# EAGLE schematic MotionDetectorCamera (EAGLE 9.6.2)

## Sheet 1 of 9: VDD
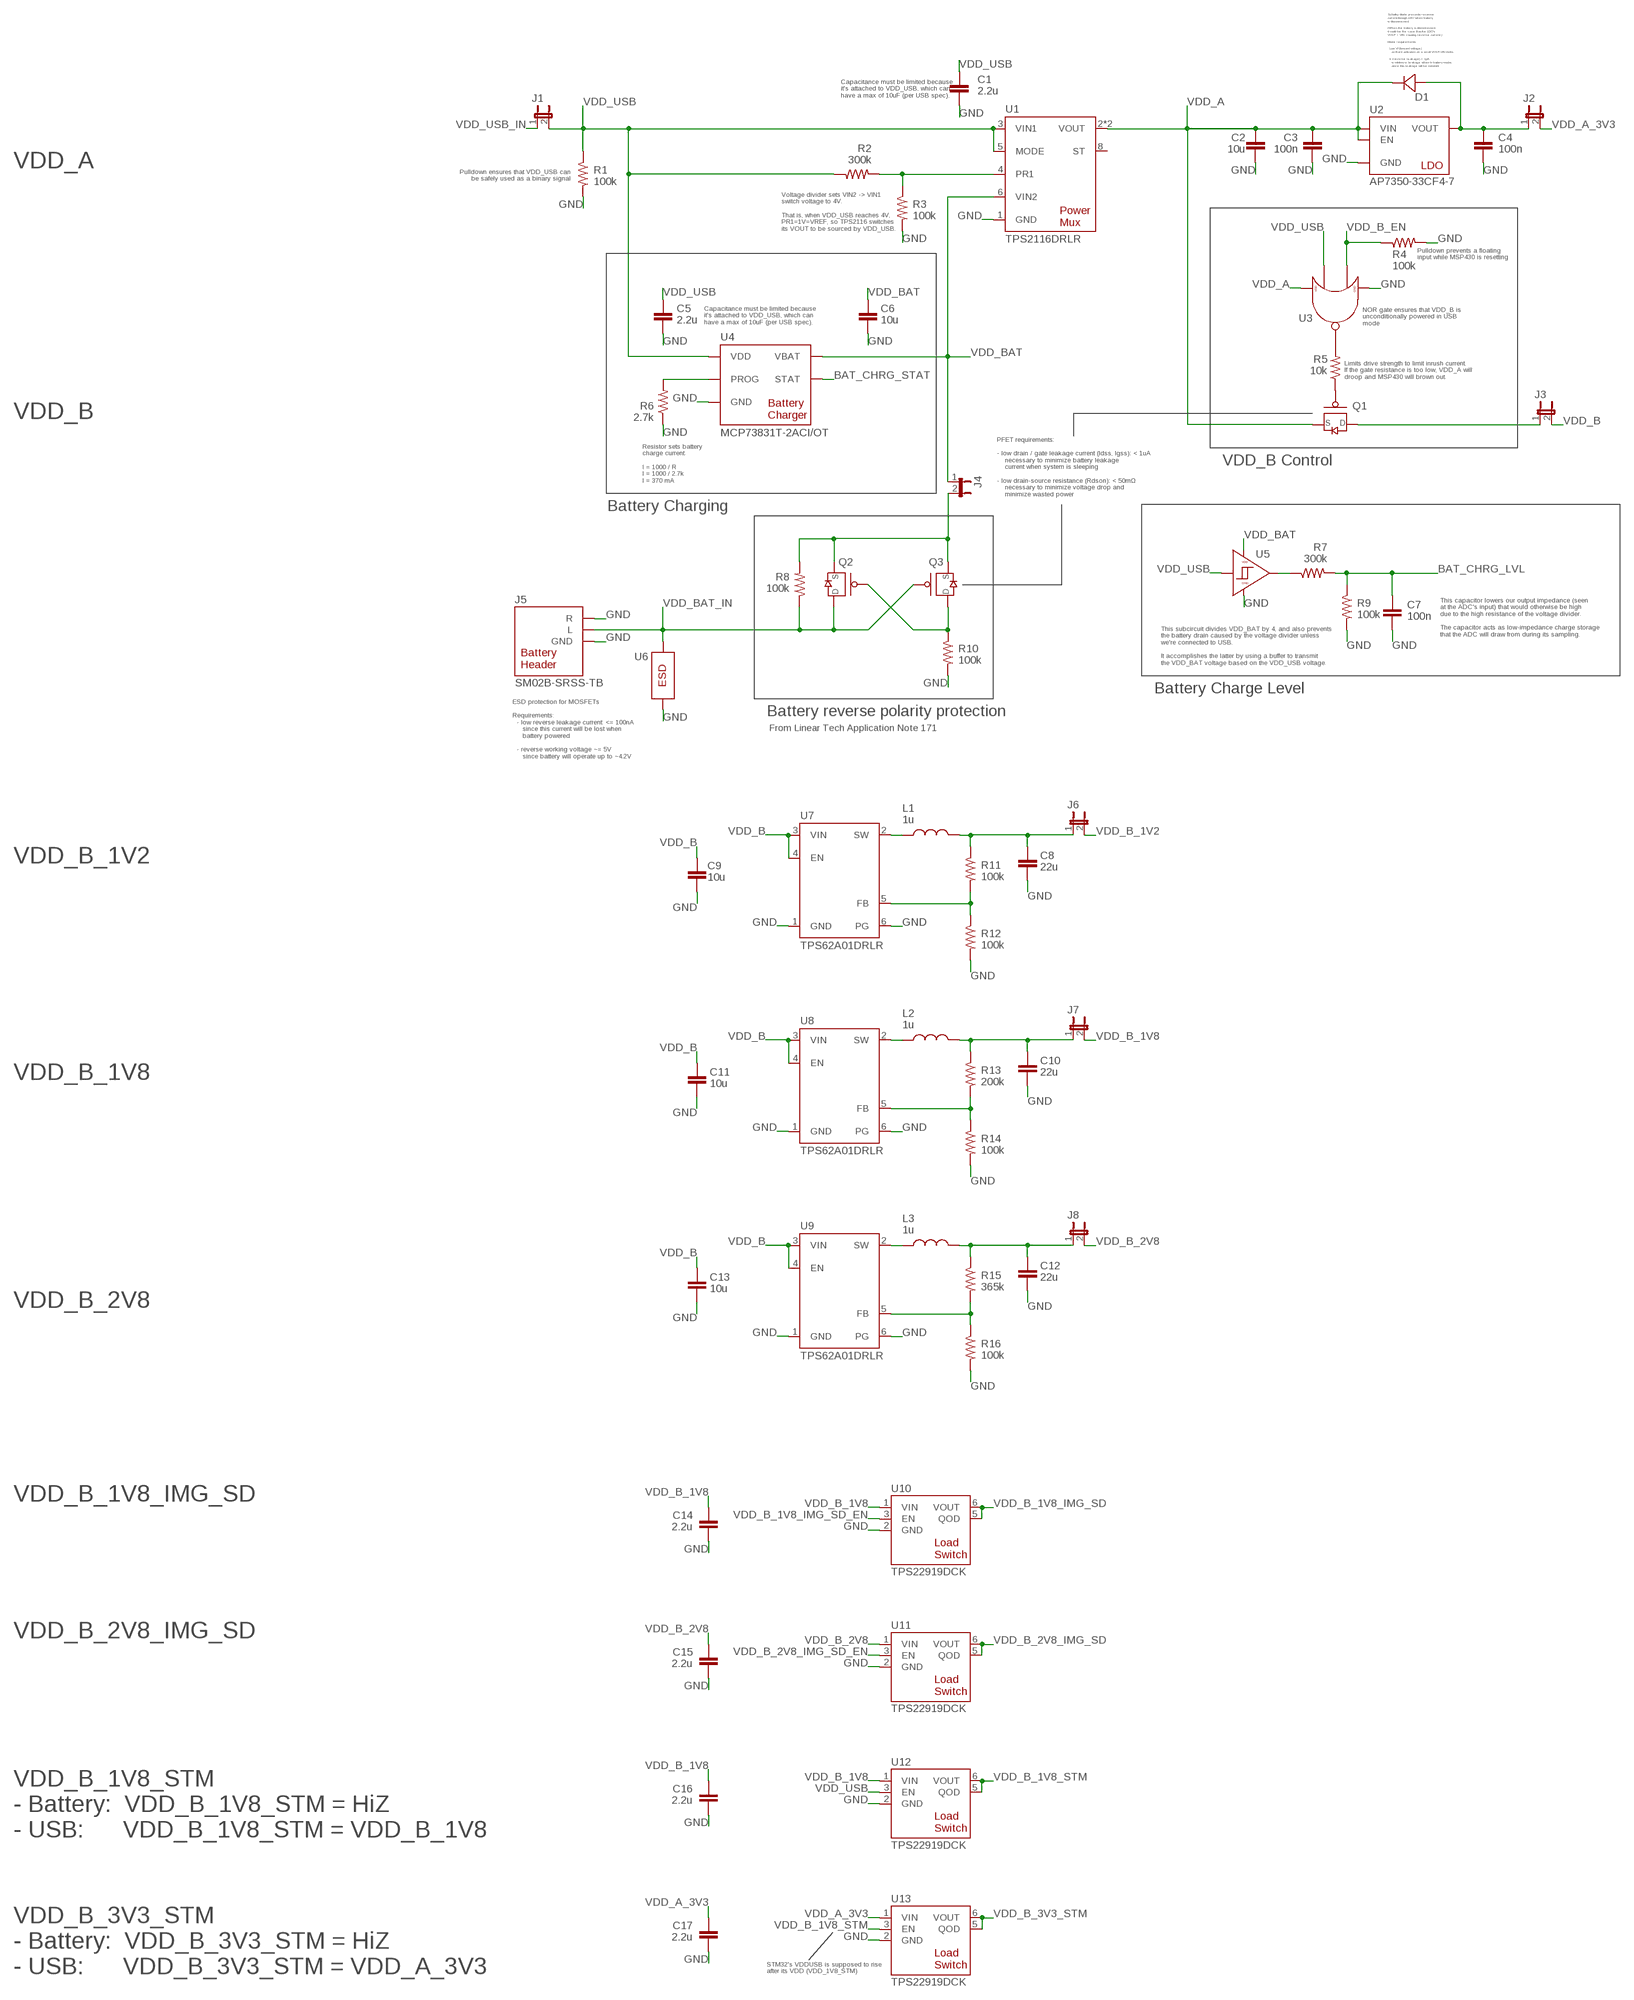
[diagram p0: schematic, sheet 1]

### Parts
C1  2.2u  CAPACITOR0402  [0402]
C2  10u  CAPACITOR0805  [0805]
C3  100n  CAPACITOR0402  [0402]
C4  100n  CAPACITOR0402  [0402]
C5  2.2u  CAPACITOR0402  [0402]
C6  10u  CAPACITOR0805  [0805]
C7  100n  CAPACITOR0402  [0402]
C8  22u  CAPACITOR0805  [0805]
C9  10u  CAPACITOR0805  [0805]
C10  22u  CAPACITOR0805  [0805]
C11  10u  CAPACITOR0805  [0805]
C12  22u  CAPACITOR0805  [0805]
C13  10u  CAPACITOR0805  [0805]
C14  2.2u  CAPACITOR0402  [0402]
C15  2.2u  CAPACITOR0402  [0402]
C16  2.2u  CAPACITOR0402  [0402]
C17  2.2u  CAPACITOR0402  [0402]
D1  ROHM-RB168MM-40  [ROHM-SOD-123FL]
J1  JUMPER-SOLDER  [JUMPER-SOLDER]
J2  JUMPER-SOLDER  [JUMPER-SOLDER]
J3  JUMPER-SOLDER  [JUMPER-SOLDER]
J4  JUMPER-SOLDER  [JUMPER-SOLDER]
J5  JST-SM02B-SRSS-TB  [JST-SM02B-SRSS-TB]
J6  JUMPER-SOLDER  [JUMPER-SOLDER]
J7  JUMPER-SOLDER  [JUMPER-SOLDER]
J8  JUMPER-SOLDER  [JUMPER-SOLDER]
L1  1u  INDUCTOR0806  [0806]
L2  1u  INDUCTOR0806  [0806]
L3  1u  INDUCTOR0806  [0806]
Q1  PMOS-NEXPERIA-SOT1220  [NEXPERIA-SOT1220]
Q2  PMOS-NEXPERIA-SOT1220  [NEXPERIA-SOT1220]
Q3  PMOS-NEXPERIA-SOT1220  [NEXPERIA-SOT1220]
R1  100k  RESISTOR0402  [0402]
R2  300k  RESISTOR0402  [0402]
R3  100k  RESISTOR0402  [0402]
R4  100k  RESISTOR0402  [0402]
R5  10k  RESISTOR0402  [0402]
R6  2.7k  RESISTOR0402  [0402]
R7  300k  RESISTOR0402  [0402]
R8  100k  RESISTOR0402  [0402]
R9  100k  RESISTOR0402  [0402]
R10  100k  RESISTOR0402  [0402]
R11  100k  RESISTOR0402  [0402]
R12  100k  RESISTOR0402  [0402]
R13  200k  RESISTOR0402  [0402]
R14  100k  RESISTOR0402  [0402]
R15  365k  RESISTOR0402  [0402]
R16  100k  RESISTOR0402  [0402]
U1  TI-TPS2116  [TI-TPS2116DRLR]
U2  DIODESINC-AP7350  [DIODESINC-AP7350]
U3  NEXPERIA-74LVC1G98-NOR  [NEXPERIA-SOT363]
U4  MICROCHIP-MCP7383X  [MICROCHIP-MIC550X-SOT23-5]
U5  NEXPERIA-74LVC1G98-BUFFER  [NEXPERIA-SOT363]
U6  EATON-STN101  [EATON-STN101]
U7  TI-TPS62A01  [TI-TPS62A01DRLR]
U8  TI-TPS62A01  [TI-TPS62A01DRLR]
U9  TI-TPS62A01  [TI-TPS62A01DRLR]
U10  TI-TPS22919DCK  [TI-TPS22919DCK]
U11  TI-TPS22919DCK  [TI-TPS22919DCK]
U12  TI-TPS22919DCK  [TI-TPS22919DCK]
U13  TI-TPS22919DCK  [TI-TPS22919DCK]

### Nets
BAT_CHRG_LVL: C7.1 R7.2 R9.1 ; also sheet 8
BAT_CHRG_STAT: U4.1(STAT) ; also sheet 8
GND: C1.2 C2.2 C3.2 C4.2 C5.2 C6.2 C7.2 C8.2 C9.2 C10.2 C11.2 C12.2 C13.2 C14.2 C15.2 C16.2 C17.2 J5.GND1(GND) J5.GND2(GND) J5.R R1.2 R3.2 R4.2 R6.1 R9.2 R10.2 R12.2 R14.2 R16.2 U1.1(GND) U2.2(GND) U3.2(GND) U4.2(GND) U5.2(GND) U5.3(GND) U6.2 U7.1(GND) U7.6(PG) U8.1(GND) U8.6(PG) U9.1(GND) U9.6(PG) U10.2(GND) U11.2(GND) U12.2(GND) U13.2(GND) ; also sheet 2,3,4,5,6,7,8,9
N$1: J4.2 Q2.4(S) Q2.8(S) Q3.4(S) Q3.8(S) R8.2
N$3: C4.1 D1.1(A) J2.1 U2.3(VOUT)
N$9: R7.1 U5.4(OUT)
N$11: Q1.3(G) R5.1
N$12: R5.2 U3.4(OUT)
N$13: C12.1 J8.1 L3.2 R15.1
N$15: L2.1 U8.2(SW)
N$18: R13.2 R14.1 U8.5(FB)
N$19: C10.1 J7.1 L2.2 R13.1
N$21: R6.2 U4.5(PROG)
N$22: L3.1 U9.2(SW)
N$24: L1.1 U7.2(SW)
N$32: Q2.3(G) Q3.1(D) Q3.2(D) Q3.5(D) Q3.6(D) Q3.7(D) R10.1
N$33: R15.2 R16.1 U9.5(FB)
N$34: R11.2 R12.1 U7.5(FB)
N$38: C8.1 J6.1 L1.2 R11.1
N$42: R2.2 R3.1 U1.4(PR1)
N$43: J3.1 Q1.1(D) Q1.2(D) Q1.5(D) Q1.6(D) Q1.7(D)
VDD_A: C2.1 C3.1 D1.2(C) Q1.4(S) Q1.8(S) U1.2(VOUT) U1.7(VOUT) U2.1(EN) U2.4(VIN) U3.3(VDD) U3.5(VDD)
VDD_A_3V3: C17.1 J2.2 U13.1(VIN) ; also sheet 2,3
VDD_B: C9.1 C11.1 C13.1 J3.2 U7.3(VIN) U7.4(EN) U8.3(VIN) U8.4(EN) U9.3(VIN) U9.4(EN)
VDD_B_1V2: J6.2 ; also sheet 4
VDD_B_1V8: C14.1 C16.1 J7.2 U10.1(VIN) U12.1(VIN) ; also sheet 2,4,6
VDD_B_1V8_IMG_SD: U10.5(QOD) U10.6(VOUT) ; also sheet 5,7
VDD_B_1V8_IMG_SD_EN: U10.3(EN) ; also sheet 2,8
VDD_B_1V8_STM: U12.5(QOD) U12.6(VOUT) U13.3(EN) ; also sheet 2,8
VDD_B_2V8: C15.1 J8.2 U11.1(VIN) ; also sheet 4
VDD_B_2V8_IMG_SD: U11.5(QOD) U11.6(VOUT) ; also sheet 5,7
VDD_B_2V8_IMG_SD_EN: U11.3(EN) ; also sheet 2,8
VDD_B_3V3_STM: U13.5(QOD) U13.6(VOUT) ; also sheet 8
VDD_B_EN: R4.1 U3.6(IN2) ; also sheet 2
VDD_BAT: C6.1 J4.1 U1.6(VIN2) U4.3(VBAT) U5.1(VDD) U5.5(VDD)
VDD_BAT_IN: J5.L Q2.1(D) Q2.2(D) Q2.5(D) Q2.6(D) Q2.7(D) Q3.3(G) R8.1 U6.1
VDD_USB: C1.1 C5.1 J1.2 R1.1 R2.1 U1.3(VIN1) U1.5(MODE) U3.1(IN1) U4.4(VDD) U5.6(IN) U12.3(EN)
VDD_USB_IN: J1.1 ; also sheet 8,9
Unconnected: U1.8(ST)

### Notes on the sheet
- Schottky diode prevents reverse
  current through LDO when battery
  is disconnected.
  
  (When the battery is disconnected,
  it could be the case that the LDO's
  VOUT > VIN, causing reverse current.)
  
  Diode requirements:
  
  - Low Vf (forward voltage)
      so that it activates on a small VOUT-VIN delta
  
  - Ir (reverse leakage) < 1µA
      to minimize leakage when in battery-mode,
      since this leakage will be constant
- Capacitance must be limited because
  it's attached to VDD_USB, which can
  have a max of 10uF (per USB spec).
- VDD_A
- Pulldown ensures that VDD_USB can
  be safely used as a binary signal
- Voltage divider sets VIN2 -> VIN1
  switch voltage to 4V.
  
  That is, when VDD_USB reaches 4V,
  PR1=1V=VREF, so TPS2116 switches
  its VOUT to be sourced by VDD_USB.
- Pulldown prevents a floating
  input while MSP430 is resetting
- Capacitance must be limited because
  it's attached to VDD_USB, which can
  have a max of 10uF (per USB spec).
- NOR gate ensures that VDD_B is
  unconditionally powered in USB
  mode
- Limits drive strength to limit inrush current.
  If the gate resistance is too low, VDD_A will
  droop and MSP430 will brown out.
- VDD_B
- PFET requirements:
  
  - low drain / gate leakage current (Idss, Igss): < 1uA
      necessary to minimize battery leakage
      current when system is sleeping
  
  - low drain-source resistance (Rdson): < 50mΩ
      necessary to minimize voltage drop and
      minimize wasted power
- Resistor sets battery
  charge current:
  
  I = 1000 / R
  I = 1000 / 2.7k
  I = 370 mA
- VDD_B Control
- Battery Charging
- This capacitor lowers our output impedance (seen
  at the ADC's input) that would otherwise be high
  due to the high resistance of the voltage divider.
  
  The capacitor acts as low-impedance charge storage
  that the ADC will draw from during its sampling.
- This subcircuit divides VDD_BAT by 4, and also prevents
  the battery drain caused by the voltage divider unless
  we're connected to USB.
  
  It accomplishes the latter by using a buffer to transmit
  the VDD_BAT voltage based on the VDD_USB voltage.
- Battery Charge Level
- ESD protection for MOSFETs
  
  Requirements:
    - low reverse leakage current: <= 100nA
       since this current will be lost when
       battery powered
  
    - reverse working voltage ~= 5V
       since battery will operate up to ~4.2V
- Battery reverse polarity protection
- From Linear Tech Application Note 171
- VDD_B_1V2
- VDD_B_1V8
- VDD_B_2V8
- VDD_B_1V8_IMG_SD
- VDD_B_2V8_IMG_SD
- VDD_B_1V8_STM
  - Battery:  VDD_B_1V8_STM = HiZ
  - USB:      VDD_B_1V8_STM = VDD_B_1V8
- VDD_B_3V3_STM
  - Battery:  VDD_B_3V3_STM = HiZ
  - USB:      VDD_B_3V3_STM = VDD_A_3V3
- STM32's VDDUSB is supposed to rise
  after its VDD (VDD_1V8_STM)

## Sheet 2 of 9: MSP
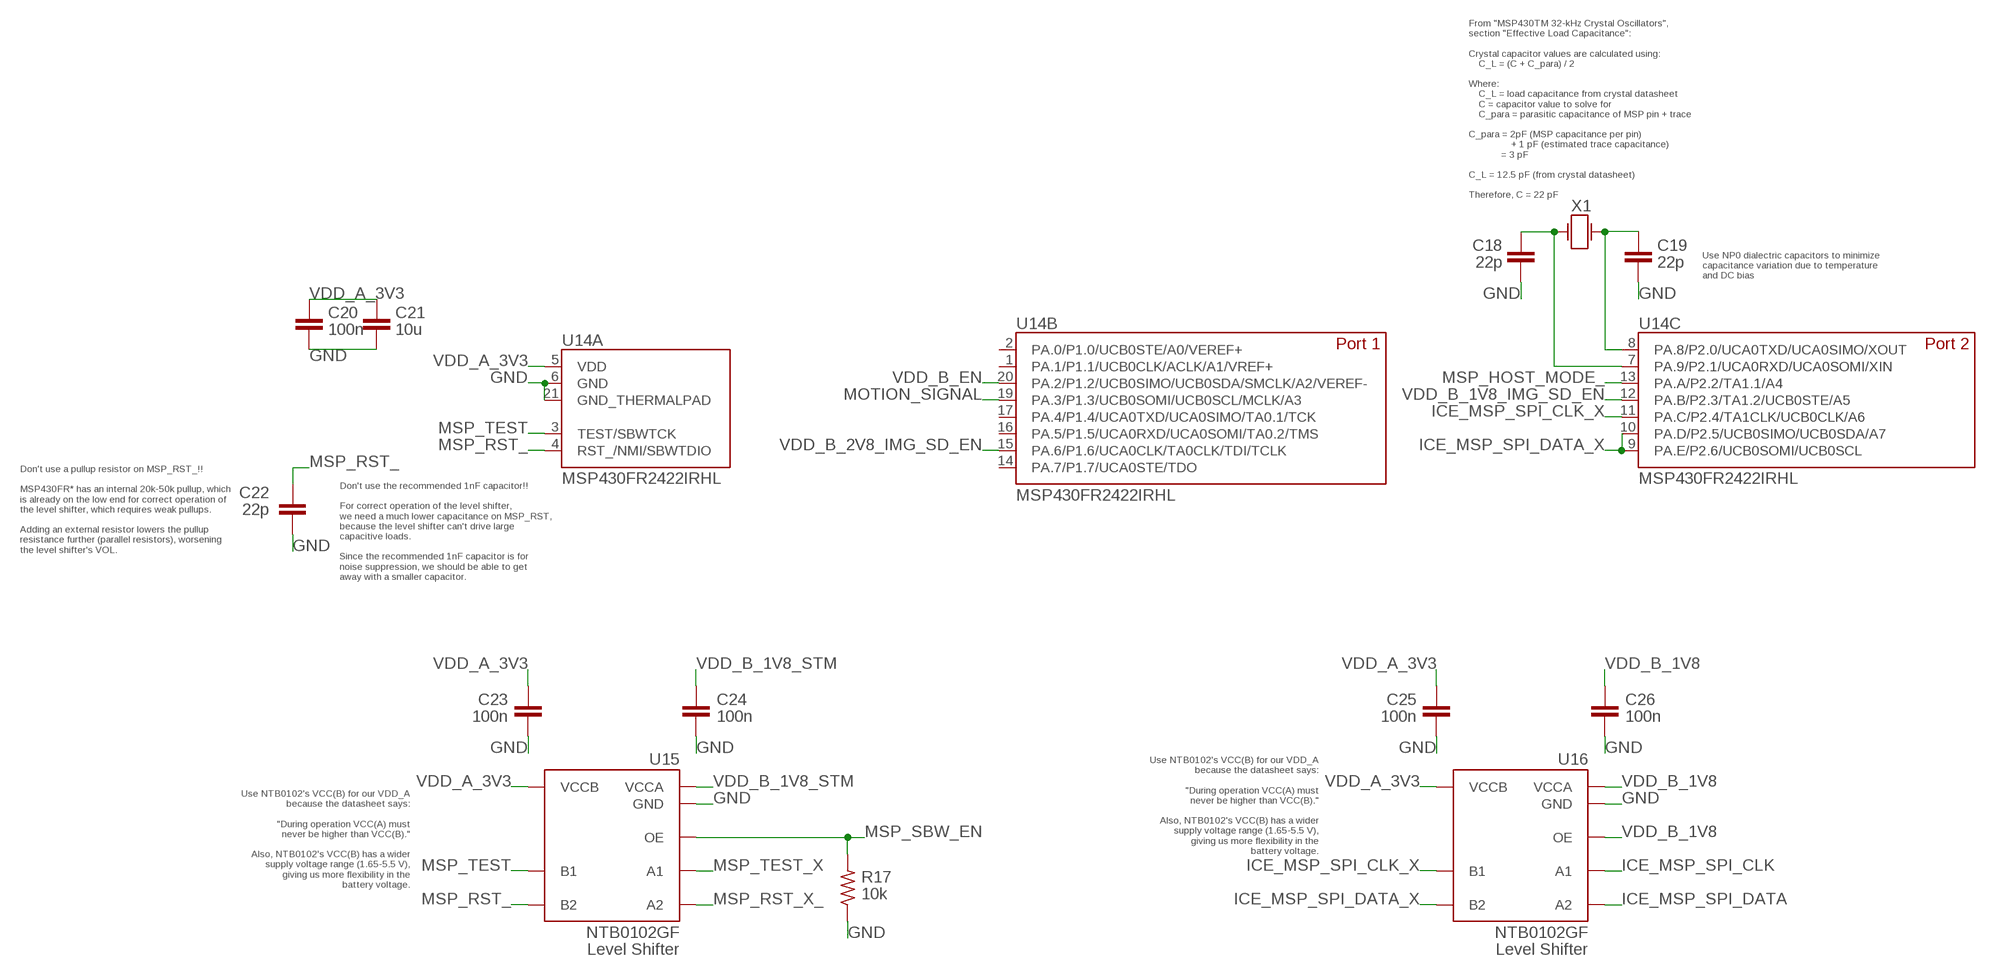
[diagram p1: schematic, sheet 2]

### Parts
C18  22p  CAPACITOR0402  [0402]
C19  22p  CAPACITOR0402  [0402]
C20  100n  CAPACITOR0402  [0402]
C21  10u  CAPACITOR0805  [0805]
C22  22p  CAPACITOR0402  [0402]
C23  100n  CAPACITOR0402  [0402]
C24  100n  CAPACITOR0402  [0402]
C25  100n  CAPACITOR0402  [0402]
C26  100n  CAPACITOR0402  [0402]
R17  10k  RESISTOR0402  [0402]
U14  TI-MSP430FR2422IRHL  [TI-MSP430FR2422IRHL]
U15  NXP-NTB0102  [NXP-NTB0102GF]
U16  NXP-NTB0102  [NXP-NTB0102GF]
X1  EPSON-FC-135  [EPSON-FC-135]

### Nets
GND: C18.2 C19.2 C20.2 C21.2 C22.2 C23.2 C24.2 C25.2 C26.2 R17.1 U14.6(A:GND) U14.21(A:GND_THERMALPAD) U15.2(GND) U16.2(GND) ; also sheet 1,3,4,5,6,7,8,9
ICE_MSP_SPI_CLK: U16.5(A1) ; also sheet 4
ICE_MSP_SPI_CLK_X: U14.11(C:PA.C/P2.4/TA1CLK/UCB0CLK/A6) U16.8(B1)
ICE_MSP_SPI_DATA: U16.4(A2) ; also sheet 4
ICE_MSP_SPI_DATA_X: U14.9(C:PA.E/P2.6/UCB0SOMI/UCB0SCL) U14.10(C:PA.D/P2.5/UCB0SIMO/UCB0SDA/A7) U16.1(B2)
MOTION_SIGNAL: U14.19(B:PA.3/P1.3/UCB0SOMI/UCB0SCL/MCLK/A3) ; also sheet 3
MSP_HOST_MODE_: U14.13(C:PA.A/P2.2/TA1.1/A4) ; also sheet 8
MSP_RST_: C22.1 U14.4(A:RST_/NMI/SBWTDIO) U15.1(B2)
MSP_RST_X_: U15.4(A2) ; also sheet 8
MSP_SBW_EN: R17.2 U15.6(OE) ; also sheet 8
MSP_TEST: U14.3(A:TEST/SBWTCK) U15.8(B1)
MSP_TEST_X: U15.5(A1) ; also sheet 8
N$14: C19.1 U14.8(C:PA.8/P2.0/UCA0TXD/UCA0SIMO/XOUT) X1.2(B)
N$17: C18.1 U14.7(C:PA.9/P2.1/UCA0RXD/UCA0SOMI/XIN) X1.1(A)
VDD_A_3V3: C20.1 C21.1 C23.1 C25.1 U14.5(A:VDD) U15.7(VCCB) U16.7(VCCB) ; also sheet 1,3
VDD_B_1V8: C26.1 U16.3(VCCA) U16.6(OE) ; also sheet 1,4,6
VDD_B_1V8_IMG_SD_EN: U14.12(C:PA.B/P2.3/TA1.2/UCB0STE/A5) ; also sheet 1,8
VDD_B_1V8_STM: C24.1 U15.3(VCCA) ; also sheet 1,8
VDD_B_2V8_IMG_SD_EN: U14.15(B:PA.6/P1.6/UCA0CLK/TA0CLK/TDI/TCLK) ; also sheet 1,8
VDD_B_EN: U14.20(B:PA.2/P1.2/UCB0SIMO/UCB0SDA/SMCLK/A2/VEREF-) ; also sheet 1
Unconnected: U14.1(B:PA.1/P1.1/UCB0CLK/ACLK/A1/VREF+) U14.2(B:PA.0/P1.0/UCB0STE/A0/VEREF+) U14.14(B:PA.7/P1.7/UCA0STE/TDO) U14.16(B:PA.5/P1.5/UCA0RXD/UCA0SOMI/TA0.2/TMS) U14.17(B:PA.4/P1.4/UCA0TXD/UCA0SIMO/TA0.1/TCK)

### Notes on the sheet
- From "MSP430TM 32-kHz Crystal Oscillators",
  section "Effective Load Capacitance":
  
  Crystal capacitor values are calculated using:
      C_L = (C + C_para) / 2
  
  Where:
      C_L = load capacitance from crystal datasheet
      C = capacitor value to solve for
      C_para = parasitic capacitance of MSP pin + trace
  
  C_para = 2pF (MSP capacitance per pin)
                   + 1 pF (estimated trace capacitance)
               = 3 pF
  
  C_L = 12.5 pF (from crystal datasheet)
  
  Therefore, C = 22 pF
- Use NP0 dialectric capacitors to minimize
  capacitance variation due to temperature
  and DC bias
- Don't use a pullup resistor on MSP_RST_!!
  
  MSP430FR* has an internal 20k-50k pullup, which
  is already on the low end for correct operation of
  the level shifter, which requires weak pullups.
  
  Adding an external resistor lowers the pullup
  resistance further (parallel resistors), worsening
  the level shifter's VOL.
- Don't use the recommended 1nF capacitor!!
  
  For correct operation of the level shifter,
  we need a much lower capacitance on MSP_RST,
  because the level shifter can't drive large
  capacitive loads.
  
  Since the recommended 1nF capacitor is for
  noise suppression, we should be able to get
  away with a smaller capacitor.
- Use NTB0102's VCC(B) for our VDD_A
  because the datasheet says:
  
  "During operation VCC(A) must
  never be higher than VCC(B)."
  
  Also, NTB0102's VCC(B) has a wider
  supply voltage range (1.65-5.5 V),
  giving us more flexibility in the
  battery voltage.
- Use NTB0102's VCC(B) for our VDD_A
  because the datasheet says:
  
  "During operation VCC(A) must
  never be higher than VCC(B)."
  
  Also, NTB0102's VCC(B) has a wider
  supply voltage range (1.65-5.5 V),
  giving us more flexibility in the
  battery voltage.

## Sheet 3 of 9: MOTION
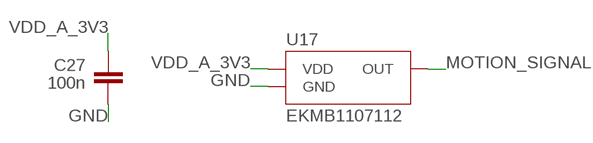
[diagram p2: schematic, sheet 3]

### Parts
C27  100n  CAPACITOR0402  [0402]
U17  PANASONIC-EKMB110711X  [PANASONIC-EKMB110711X]

### Nets
GND: C27.2 U17.3(GND) ; also sheet 1,2,4,5,6,7,8,9
MOTION_SIGNAL: U17.2(OUT) ; also sheet 2
VDD_A_3V3: C27.1 U17.1(VDD) ; also sheet 1,2

## Sheet 4 of 9: ICE
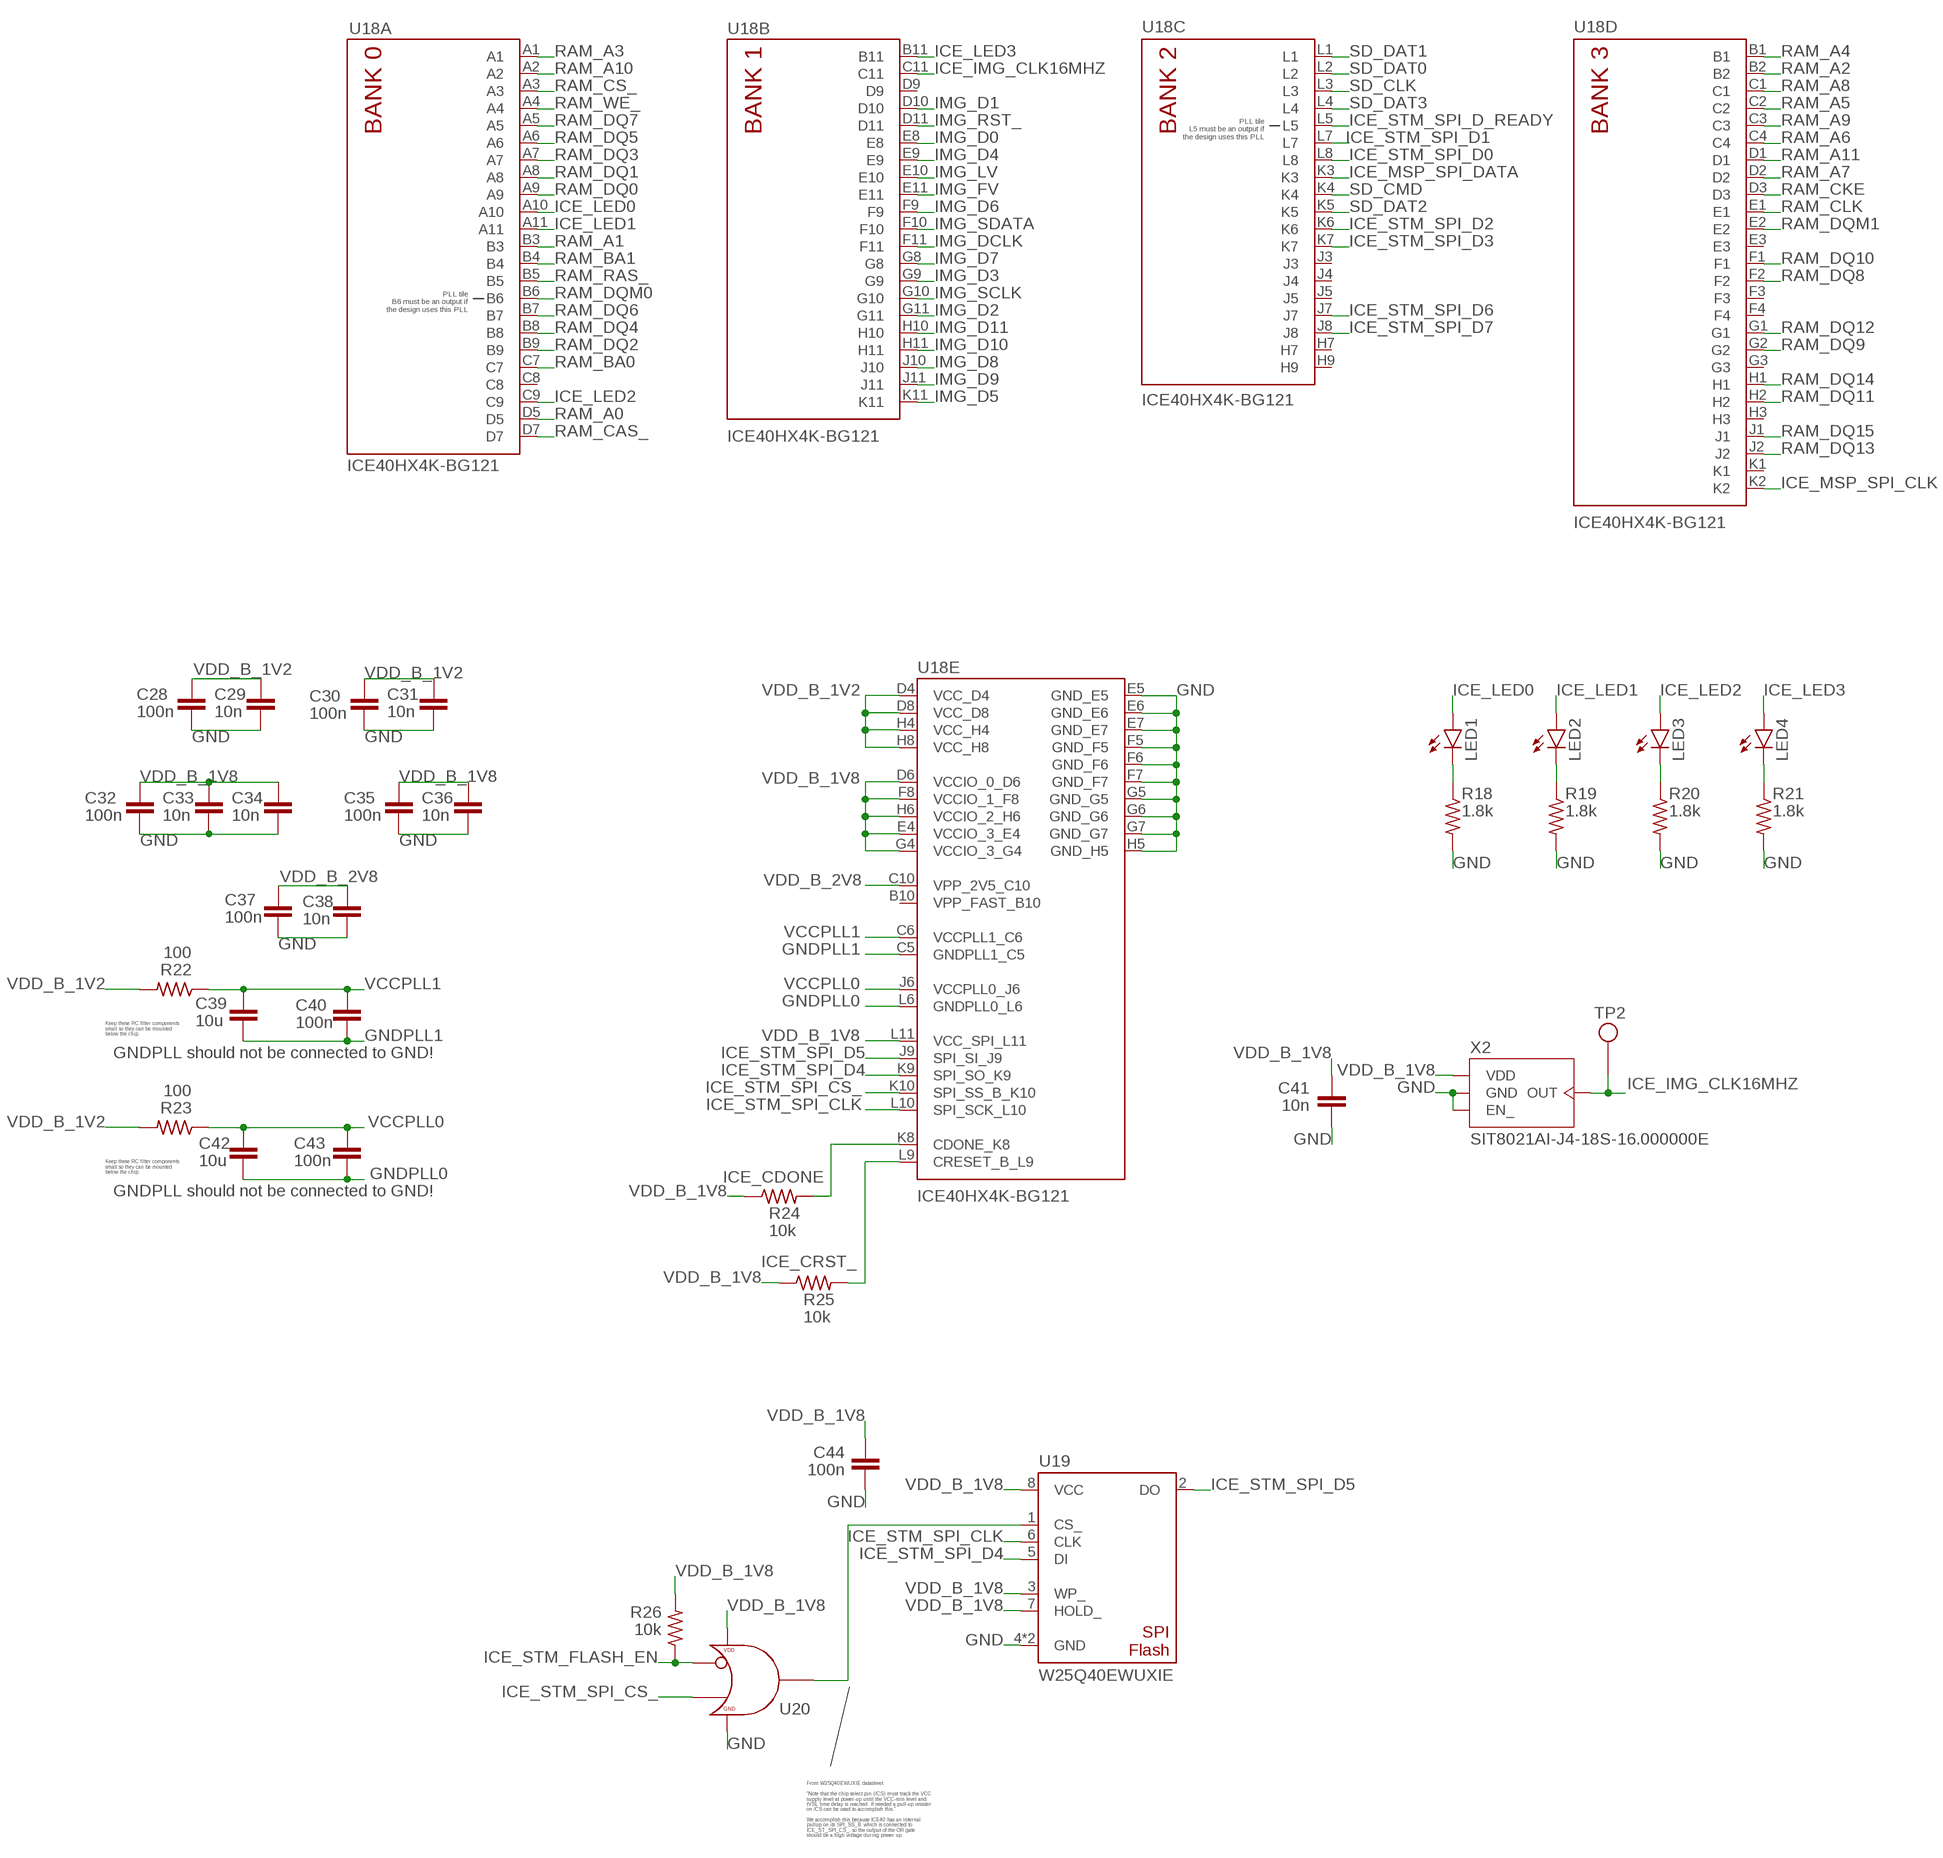
[diagram p3: schematic, sheet 4]

### Parts
C28  100n  CAPACITOR0402  [0402]
C29  10n  CAPACITOR0402  [0402]
C30  100n  CAPACITOR0402  [0402]
C31  10n  CAPACITOR0402  [0402]
C32  100n  CAPACITOR0402  [0402]
C33  10n  CAPACITOR0402  [0402]
C34  10n  CAPACITOR0402  [0402]
C35  100n  CAPACITOR0402  [0402]
C36  10n  CAPACITOR0402  [0402]
C37  100n  CAPACITOR0402  [0402]
C38  10n  CAPACITOR0402  [0402]
C39  10u  CAPACITOR0805  [0805]
C40  100n  CAPACITOR0402  [0402]
C41  10n  CAPACITOR0402  [0402]
C42  10u  CAPACITOR0805  [0805]
C43  100n  CAPACITOR0402  [0402]
C44  100n  CAPACITOR0402  [0402]
LED1  LED  [LED-0603]
LED2  LED  [LED-0603]
LED3  LED  [LED-0603]
LED4  LED  [LED-0603]
R18  1.8k  RESISTOR0402  [0402]
R19  1.8k  RESISTOR0402  [0402]
R20  1.8k  RESISTOR0402  [0402]
R21  1.8k  RESISTOR0402  [0402]
R22  100  RESISTOR0402  [0402]
R23  100  RESISTOR0402  [0402]
R24  10k  RESISTOR0402  [0402]
R25  10k  RESISTOR0402  [0402]
R26  10k  RESISTOR0402  [0402]
TP2  TEST-POINT  [TEST-POINT]
U18  LATTICE-ICE40HX4K-BG121  [LATTICE-ICE40HX4K-BG121]
U19  WINBOND-W25Q40EW  [WINBOND-W25Q40EWUXIE]
U20  NEXPERIA-74LVC1G98-OR-INV-INPUT  [NEXPERIA-SOT363]
X2  SITIME-SIT8021  [SITIME-SIT8021]

### Nets
GND: C28.2 C29.2 C30.2 C31.2 C32.2 C33.2 C34.2 C35.2 C36.2 C37.2 C38.2 C41.2 C44.2 R18.2 R19.2 R20.2 R21.2 U18.E5(E:GND_E5) U18.E6(E:GND_E6) U18.E7(E:GND_E7) U18.F5(E:GND_F5) U18.F6(E:GND_F6) U18.F7(E:GND_F7) U18.G5(E:GND_G5) U18.G6(E:GND_G6) U18.G7(E:GND_G7) U18.H5(E:GND_H5) U19.4(GND) U19.9(GND) U20.2(GND) U20.3(GND) X2.1(EN_) X2.4(GND) ; also sheet 1,2,3,5,6,7,8,9
GNDPLL0: C42.2 C43.2 U18.L6(E:GNDPLL0_L6)
GNDPLL1: C39.2 C40.2 U18.C5(E:GNDPLL1_C5)
ICE_CDONE: R24.2 U18.K8(E:CDONE_K8) ; also sheet 8
ICE_CRST_: R25.2 U18.L9(E:CRESET_B_L9) ; also sheet 8
ICE_IMG_CLK16MHZ: TP2.X U18.C11(B:C11) X2.2(OUT) ; also sheet 5
ICE_LED0: LED1.A U18.A10(A:A10)
ICE_LED1: LED2.A U18.A11(A:A11)
ICE_LED2: LED3.A U18.C9(A:C9)
ICE_LED3: LED4.A U18.B11(B:B11)
ICE_MSP_SPI_CLK: U18.K2(D:K2) ; also sheet 2
ICE_MSP_SPI_DATA: U18.K3(C:K3) ; also sheet 2
ICE_STM_FLASH_EN: R26.1 U20.1(IN1) ; also sheet 8
ICE_STM_SPI_CLK: U18.L10(E:SPI_SCK_L10) U19.6(CLK) ; also sheet 8
ICE_STM_SPI_CS_: U18.K10(E:SPI_SS_B_K10) U20.6(IN2) ; also sheet 8
ICE_STM_SPI_D0: U18.L8(C:L8) ; also sheet 8
ICE_STM_SPI_D1: U18.L7(C:L7) ; also sheet 8
ICE_STM_SPI_D2: U18.K6(C:K6) ; also sheet 8
ICE_STM_SPI_D3: U18.K7(C:K7) ; also sheet 8
ICE_STM_SPI_D4: U18.K9(E:SPI_SO_K9) U19.5(DI) ; also sheet 8
ICE_STM_SPI_D5: U18.J9(E:SPI_SI_J9) U19.2(DO) ; also sheet 8
ICE_STM_SPI_D6: U18.J7(C:J7) ; also sheet 8
ICE_STM_SPI_D7: U18.J8(C:J8) ; also sheet 8
ICE_STM_SPI_D_READY: U18.L5(C:L5) ; also sheet 8
IMG_D0: U18.E8(B:E8) ; also sheet 5
IMG_D1: U18.D10(B:D10) ; also sheet 5
IMG_D2: U18.G11(B:G11) ; also sheet 5
IMG_D3: U18.G9(B:G9) ; also sheet 5
IMG_D4: U18.E9(B:E9) ; also sheet 5
IMG_D5: U18.K11(B:K11) ; also sheet 5
IMG_D6: U18.F9(B:F9) ; also sheet 5
IMG_D7: U18.G8(B:G8) ; also sheet 5
IMG_D8: U18.J10(B:J10) ; also sheet 5
IMG_D9: U18.J11(B:J11) ; also sheet 5
IMG_D10: U18.H11(B:H11) ; also sheet 5
IMG_D11: U18.H10(B:H10) ; also sheet 5
IMG_DCLK: U18.F11(B:F11) ; also sheet 5
IMG_FV: U18.E11(B:E11) ; also sheet 5
IMG_LV: U18.E10(B:E10) ; also sheet 5
IMG_RST_: U18.D11(B:D11) ; also sheet 5
IMG_SCLK: U18.G10(B:G10) ; also sheet 5
IMG_SDATA: U18.F10(B:F10) ; also sheet 5
N$20: LED1.C R18.1
N$23: LED3.C R20.1
N$26: LED2.C R19.1
N$28: LED4.C R21.1
N$40: U19.1(CS_) U20.4(OUT)
RAM_A0: U18.D5(A:D5) ; also sheet 6
RAM_A1: U18.B3(A:B3) ; also sheet 6
RAM_A2: U18.B2(D:B2) ; also sheet 6
RAM_A3: U18.A1(A:A1) ; also sheet 6
RAM_A4: U18.B1(D:B1) ; also sheet 6
RAM_A5: U18.C2(D:C2) ; also sheet 6
RAM_A6: U18.C4(D:C4) ; also sheet 6
RAM_A7: U18.D2(D:D2) ; also sheet 6
RAM_A8: U18.C1(D:C1) ; also sheet 6
RAM_A9: U18.C3(D:C3) ; also sheet 6
RAM_A10: U18.A2(A:A2) ; also sheet 6
RAM_A11: U18.D1(D:D1) ; also sheet 6
RAM_BA0: U18.C7(A:C7) ; also sheet 6
RAM_BA1: U18.B4(A:B4) ; also sheet 6
RAM_CAS_: U18.D7(A:D7) ; also sheet 6
RAM_CKE: U18.D3(D:D3) ; also sheet 6
RAM_CLK: U18.E1(D:E1) ; also sheet 6
RAM_CS_: U18.A3(A:A3) ; also sheet 6
RAM_DQ0: U18.A9(A:A9) ; also sheet 6
RAM_DQ1: U18.A8(A:A8) ; also sheet 6
RAM_DQ2: U18.B9(A:B9) ; also sheet 6
RAM_DQ3: U18.A7(A:A7) ; also sheet 6
RAM_DQ4: U18.B8(A:B8) ; also sheet 6
RAM_DQ5: U18.A6(A:A6) ; also sheet 6
RAM_DQ6: U18.B7(A:B7) ; also sheet 6
RAM_DQ7: U18.A5(A:A5) ; also sheet 6
RAM_DQ8: U18.F2(D:F2) ; also sheet 6
RAM_DQ9: U18.G2(D:G2) ; also sheet 6
RAM_DQ10: U18.F1(D:F1) ; also sheet 6
RAM_DQ11: U18.H2(D:H2) ; also sheet 6
RAM_DQ12: U18.G1(D:G1) ; also sheet 6
RAM_DQ13: U18.J2(D:J2) ; also sheet 6
RAM_DQ14: U18.H1(D:H1) ; also sheet 6
RAM_DQ15: U18.J1(D:J1) ; also sheet 6
RAM_DQM0: U18.B6(A:B6) ; also sheet 6
RAM_DQM1: U18.E2(D:E2) ; also sheet 6
RAM_RAS_: U18.B5(A:B5) ; also sheet 6
RAM_WE_: U18.A4(A:A4) ; also sheet 6
SD_CLK: U18.L3(C:L3) ; also sheet 7
SD_CMD: U18.K4(C:K4) ; also sheet 7
SD_DAT0: U18.L2(C:L2) ; also sheet 7
SD_DAT1: U18.L1(C:L1) ; also sheet 7
SD_DAT2: U18.K5(C:K5) ; also sheet 7
SD_DAT3: U18.L4(C:L4) ; also sheet 7
VCCPLL0: C42.1 C43.1 R23.1 U18.J6(E:VCCPLL0_J6)
VCCPLL1: C39.1 C40.1 R22.1 U18.C6(E:VCCPLL1_C6)
VDD_B_1V2: C28.1 C29.1 C30.1 C31.1 R22.2 R23.2 U18.D4(E:VCC_D4) U18.D8(E:VCC_D8) U18.H4(E:VCC_H4) U18.H8(E:VCC_H8) ; also sheet 1
VDD_B_1V8: C32.1 C33.1 C34.1 C35.1 C36.1 C41.1 C44.1 R24.1 R25.1 R26.2 U18.D6(E:VCCIO_0_D6) U18.E4(E:VCCIO_3_E4) U18.F8(E:VCCIO_1_F8) U18.G4(E:VCCIO_3_G4) U18.H6(E:VCCIO_2_H6) U18.L11(E:VCC_SPI_L11) U19.3(WP_) U19.7(HOLD_) U19.8(VCC) U20.5(VDD) X2.3(VDD) ; also sheet 1,2,6
VDD_B_2V8: C37.1 C38.1 U18.C10(E:VPP_2V5_C10) ; also sheet 1
Unconnected: U18.B10(E:VPP_FAST_B10) U18.C8(A:C8) U18.D9(B:D9) U18.E3(D:E3) U18.F3(D:F3) U18.F4(D:F4) U18.G3(D:G3) U18.H3(D:H3) U18.H7(C:H7) U18.H9(C:H9) U18.J3(C:J3) U18.J4(C:J4) U18.J5(C:J5) U18.K1(D:K1)

### Notes on the sheet
- Keep these RC filter components
  small so they can be mounted
  below the chip.
- GNDPLL should not be connected to GND!
- Keep these RC filter components
  small so they can be mounted
  below the chip.
- GNDPLL should not be connected to GND!
- From W25Q40EWUXIE datasheet:
  
  "Note that the chip select pin (/CS) must track the VCC
  supply level at power-up until the VCC-min level and
  tVSL time delay is reached. If needed a pull-up resister
  on /CS can be used to accomplish this."
  
  We accomplish this because ICE40 has an internal
  pullup on its SPI_SS_B, which is connected to
  ICE_ST_SPI_CS_, so the output of the OR gate
  should be a high voltage during power up.

## Sheet 5 of 9: IMG
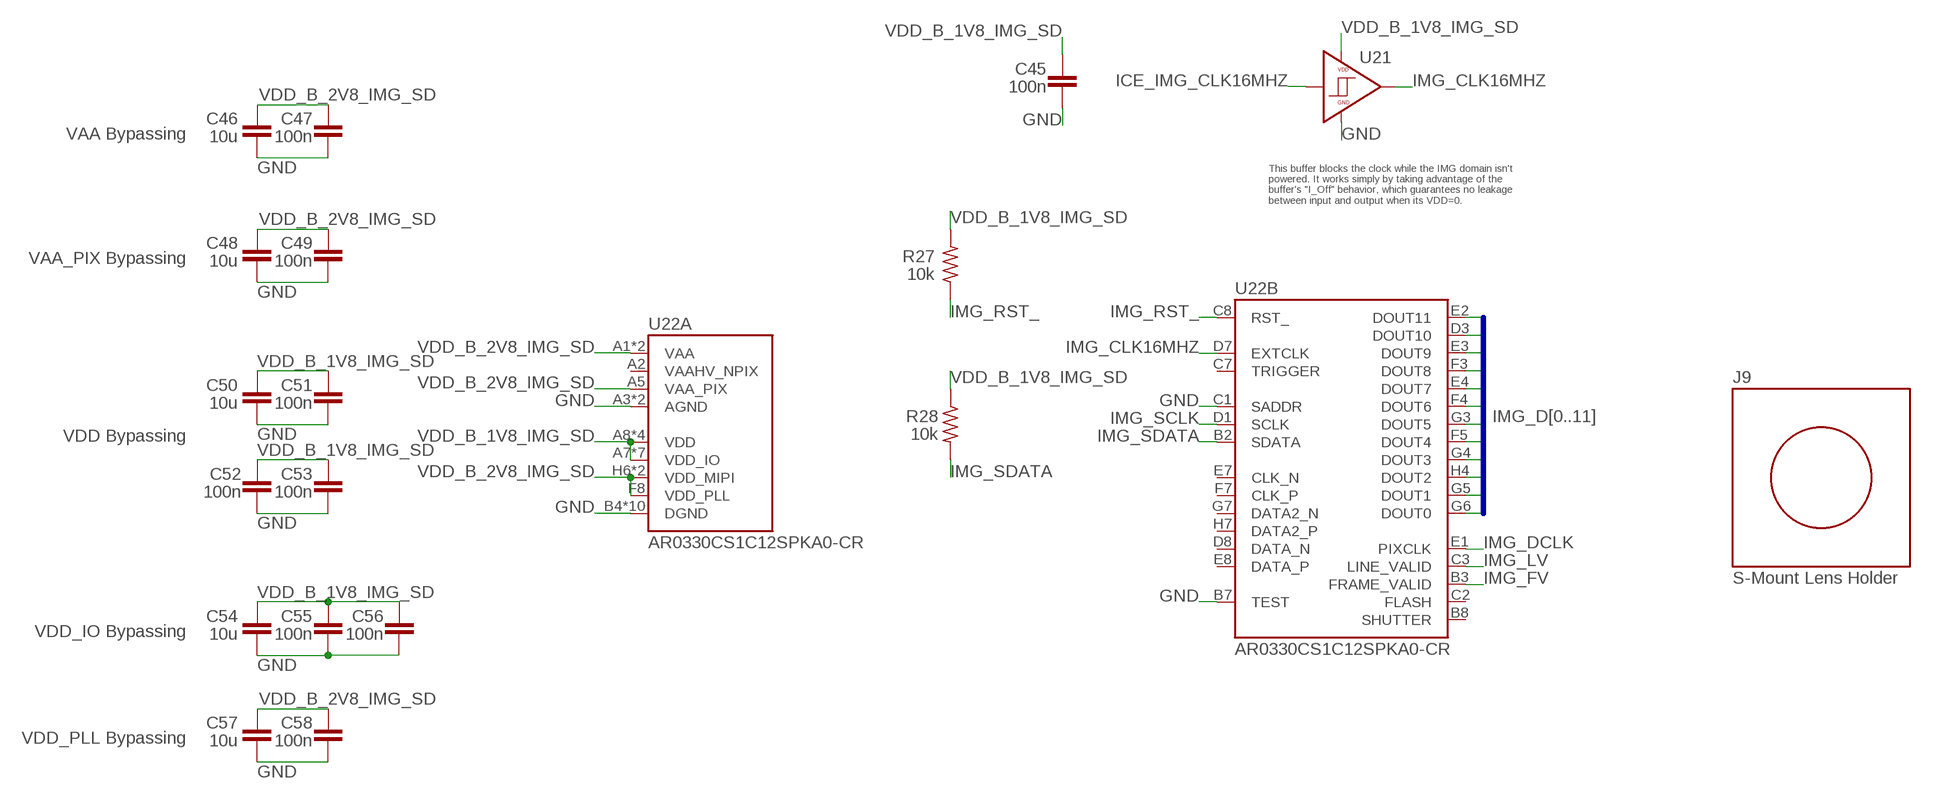
[diagram p4: schematic, sheet 5]

### Parts
C45  100n  CAPACITOR0402  [0402]
C46  10u  CAPACITOR0805  [0805]
C47  100n  CAPACITOR0402  [0402]
C48  10u  CAPACITOR0805  [0805]
C49  100n  CAPACITOR0402  [0402]
C50  10u  CAPACITOR0805  [0805]
C51  100n  CAPACITOR0402  [0402]
C52  100n  CAPACITOR0402  [0402]
C53  100n  CAPACITOR0402  [0402]
C54  10u  CAPACITOR0805  [0805]
C55  100n  CAPACITOR0402  [0402]
C56  100n  CAPACITOR0402  [0402]
C57  10u  CAPACITOR0805  [0805]
C58  100n  CAPACITOR0402  [0402]
J9  S-MOUNT-LENS-HOLDERM12LENSES-PT-LH008P  [M12LENSES-PT-LH008P]
R27  10k  RESISTOR0402  [0402]
R28  10k  RESISTOR0402  [0402]
U21  NEXPERIA-74LVC1G98-BUFFER  [NEXPERIA-SOT363]
U22  ON-AR0330CS1C12SPKA0  [ON-AR0330CS1C12SPKA0]

### Nets
GND: C45.2 C46.2 C47.2 C48.2 C49.2 C50.2 C51.2 C52.2 C53.2 C54.2 C55.2 C56.2 C57.2 C58.2 U21.2(GND) U21.3(GND) U22.A3(A:AGND) U22.B4(A:DGND) U22.B5(A:AGND) U22.B6(A:DGND) U22.B7(B:TEST) U22.C1(B:SADDR) U22.C4(A:DGND) U22.C5(A:DGND) U22.C6(A:DGND) U22.D4(A:DGND) U22.E6(A:DGND) U22.G1(A:DGND) U22.H2(A:DGND) U22.H3(A:DGND) ; also sheet 1,2,3,4,6,7,8,9
ICE_IMG_CLK16MHZ: U21.6(IN) ; also sheet 4
IMG_CLK16MHZ: U21.4(OUT) U22.D7(B:EXTCLK)
IMG_D0: U22.G6(B:DOUT0) ; also sheet 4
IMG_D1: U22.G5(B:DOUT1) ; also sheet 4
IMG_D2: U22.H4(B:DOUT2) ; also sheet 4
IMG_D3: U22.G4(B:DOUT3) ; also sheet 4
IMG_D4: U22.F5(B:DOUT4) ; also sheet 4
IMG_D5: U22.G3(B:DOUT5) ; also sheet 4
IMG_D6: U22.F4(B:DOUT6) ; also sheet 4
IMG_D7: U22.E4(B:DOUT7) ; also sheet 4
IMG_D8: U22.F3(B:DOUT8) ; also sheet 4
IMG_D9: U22.E3(B:DOUT9) ; also sheet 4
IMG_D10: U22.D3(B:DOUT10) ; also sheet 4
IMG_D11: U22.E2(B:DOUT11) ; also sheet 4
IMG_DCLK: U22.E1(B:PIXCLK) ; also sheet 4
IMG_FV: U22.B3(B:FRAME_VALID) ; also sheet 4
IMG_LV: U22.C3(B:LINE_VALID) ; also sheet 4
IMG_RST_: R27.1 U22.C8(B:RST_) ; also sheet 4
IMG_SCLK: U22.D1(B:SCLK) ; also sheet 4
IMG_SDATA: R28.2 U22.B2(B:SDATA) ; also sheet 4
VDD_B_1V8_IMG_SD: C45.1 C50.1 C51.1 C52.1 C53.1 C54.1 C55.1 C56.1 R27.2 R28.1 U21.1(VDD) U21.5(VDD) U22.A7(A:VDD_IO) U22.A8(A:VDD) U22.B1(A:VDD) U22.D2(A:VDD_IO) U22.D5(A:VDD_IO) U22.D6(A:VDD_IO) U22.E5(A:VDD_IO) U22.F6(A:VDD_IO) U22.G2(A:VDD) U22.G8(A:VDD) U22.H5(A:VDD_IO) ; also sheet 1,7
VDD_B_2V8_IMG_SD: C46.1 C47.1 C48.1 C49.1 C57.1 C58.1 U22.A1(A:VAA) U22.A5(A:VAA_PIX) U22.A6(A:VAA) U22.F8(A:VDD_PLL) U22.H6(A:VDD_MIPI) U22.H8(A:VDD_MIPI) ; also sheet 1,7
Unconnected: U22.A2(A:VAAHV_NPIX) U22.B8(B:SHUTTER) U22.C2(B:FLASH) U22.C7(B:TRIGGER) U22.D8(B:DATA_N) U22.E7(B:CLK_N) U22.E8(B:DATA_P) U22.F7(B:CLK_P) U22.G7(B:DATA2_N) U22.H7(B:DATA2_P)

### Buses
IMG_D[0..11]

### Notes on the sheet
- VAA Bypassing
- This buffer blocks the clock while the IMG domain isn't
  powered. It works simply by taking advantage of the
  buffer's "I_Off" behavior, which guarantees no leakage
  between input and output when its VDD=0.
- VAA_PIX Bypassing
- VDD Bypassing
- VDD_IO Bypassing
- VDD_PLL Bypassing

## Sheet 6 of 9: RAM
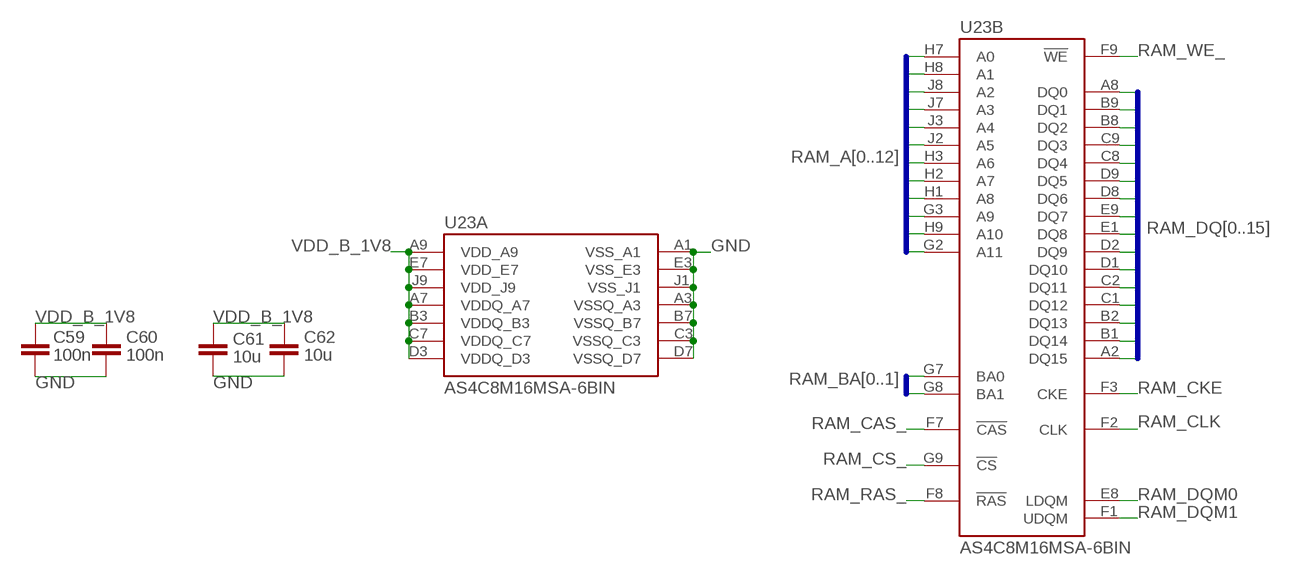
[diagram p5: schematic, sheet 6]

### Parts
C59  100n  CAPACITOR0402  [0402]
C60  100n  CAPACITOR0402  [0402]
C61  10u  CAPACITOR0805  [0805]
C62  10u  CAPACITOR0805  [0805]
U23  ALLIANCE-AS4C8M16MSA-6BIN  [ALLIANCE-AS4C8M16MSA-6BIN]

### Nets
GND: C59.2 C60.2 C61.2 C62.2 U23.A1(A:VSS_A1) U23.A3(A:VSSQ_A3) U23.B7(A:VSSQ_B7) U23.C3(A:VSSQ_C3) U23.D7(A:VSSQ_D7) U23.E3(A:VSS_E3) U23.J1(A:VSS_J1) ; also sheet 1,2,3,4,5,7,8,9
RAM_A0: U23.H7(B:A0) ; also sheet 4
RAM_A1: U23.H8(B:A1) ; also sheet 4
RAM_A2: U23.J8(B:A2) ; also sheet 4
RAM_A3: U23.J7(B:A3) ; also sheet 4
RAM_A4: U23.J3(B:A4) ; also sheet 4
RAM_A5: U23.J2(B:A5) ; also sheet 4
RAM_A6: U23.H3(B:A6) ; also sheet 4
RAM_A7: U23.H2(B:A7) ; also sheet 4
RAM_A8: U23.H1(B:A8) ; also sheet 4
RAM_A9: U23.G3(B:A9) ; also sheet 4
RAM_A10: U23.H9(B:A10) ; also sheet 4
RAM_A11: U23.G2(B:A11) ; also sheet 4
RAM_BA0: U23.G7(B:BA0) ; also sheet 4
RAM_BA1: U23.G8(B:BA1) ; also sheet 4
RAM_CAS_: U23.F7(B:!CAS!) ; also sheet 4
RAM_CKE: U23.F3(B:CKE) ; also sheet 4
RAM_CLK: U23.F2(B:CLK) ; also sheet 4
RAM_CS_: U23.G9(B:!CS!) ; also sheet 4
RAM_DQ0: U23.A8(B:DQ0) ; also sheet 4
RAM_DQ1: U23.B9(B:DQ1) ; also sheet 4
RAM_DQ2: U23.B8(B:DQ2) ; also sheet 4
RAM_DQ3: U23.C9(B:DQ3) ; also sheet 4
RAM_DQ4: U23.C8(B:DQ4) ; also sheet 4
RAM_DQ5: U23.D9(B:DQ5) ; also sheet 4
RAM_DQ6: U23.D8(B:DQ6) ; also sheet 4
RAM_DQ7: U23.E9(B:DQ7) ; also sheet 4
RAM_DQ8: U23.E1(B:DQ8) ; also sheet 4
RAM_DQ9: U23.D2(B:DQ9) ; also sheet 4
RAM_DQ10: U23.D1(B:DQ10) ; also sheet 4
RAM_DQ11: U23.C2(B:DQ11) ; also sheet 4
RAM_DQ12: U23.C1(B:DQ12) ; also sheet 4
RAM_DQ13: U23.B2(B:DQ13) ; also sheet 4
RAM_DQ14: U23.B1(B:DQ14) ; also sheet 4
RAM_DQ15: U23.A2(B:DQ15) ; also sheet 4
RAM_DQM0: U23.E8(B:LDQM) ; also sheet 4
RAM_DQM1: U23.F1(B:UDQM) ; also sheet 4
RAM_RAS_: U23.F8(B:!RAS!) ; also sheet 4
RAM_WE_: U23.F9(B:!WE!) ; also sheet 4
VDD_B_1V8: C59.1 C60.1 C61.1 C62.1 U23.A7(A:VDDQ_A7) U23.A9(A:VDD_A9) U23.B3(A:VDDQ_B3) U23.C7(A:VDDQ_C7) U23.D3(A:VDDQ_D3) U23.E7(A:VDD_E7) U23.J9(A:VDD_J9) ; also sheet 1,2,4

### Buses
RAM_A[0..12]
RAM_DQ[0..15]
RAM_BA[0..1]

## Sheet 7 of 9: SD
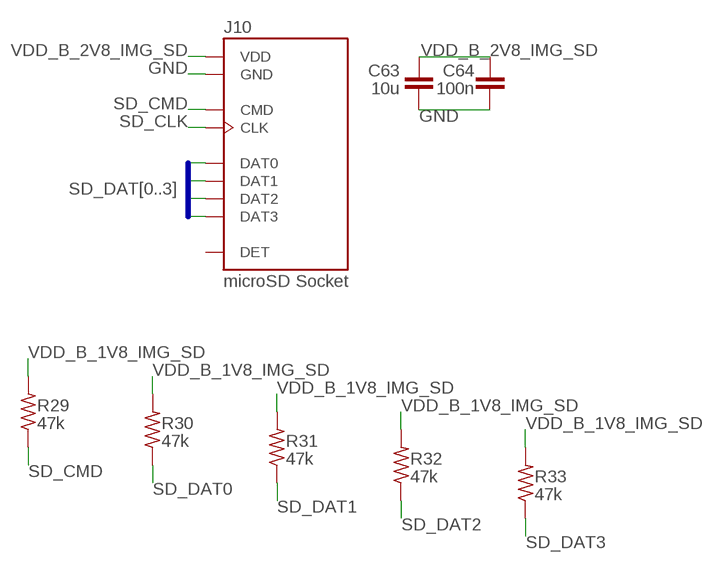
[diagram p6: schematic, sheet 7]

### Parts
C63  10u  CAPACITOR0805  [0805]
C64  100n  CAPACITOR0402  [0402]
J10  MICROSD-SOCKET  [MOLEX-1051620001]
R29  47k  RESISTOR0402  [0402]
R30  47k  RESISTOR0402  [0402]
R31  47k  RESISTOR0402  [0402]
R32  47k  RESISTOR0402  [0402]
R33  47k  RESISTOR0402  [0402]

### Nets
GND: C63.2 C64.2 J10.GND1(GND) J10.GND2(GND) J10.GND3(GND) J10.GND4(GND) J10.VSS(GND) ; also sheet 1,2,3,4,5,6,8,9
SD_CLK: J10.CLK ; also sheet 4
SD_CMD: J10.CMD R29.1 ; also sheet 4
SD_DAT0: J10.DAT0 R30.1 ; also sheet 4
SD_DAT1: J10.DAT1 R31.1 ; also sheet 4
SD_DAT2: J10.DAT2 R32.1 ; also sheet 4
SD_DAT3: J10.DAT3 R33.1 ; also sheet 4
VDD_B_1V8_IMG_SD: R29.2 R30.2 R31.2 R32.2 R33.2 ; also sheet 1,5
VDD_B_2V8_IMG_SD: C63.1 C64.1 J10.VDD ; also sheet 1,5
Unconnected: J10.DET

### Buses
SD_DAT[0..3]

## Sheet 8 of 9: STM
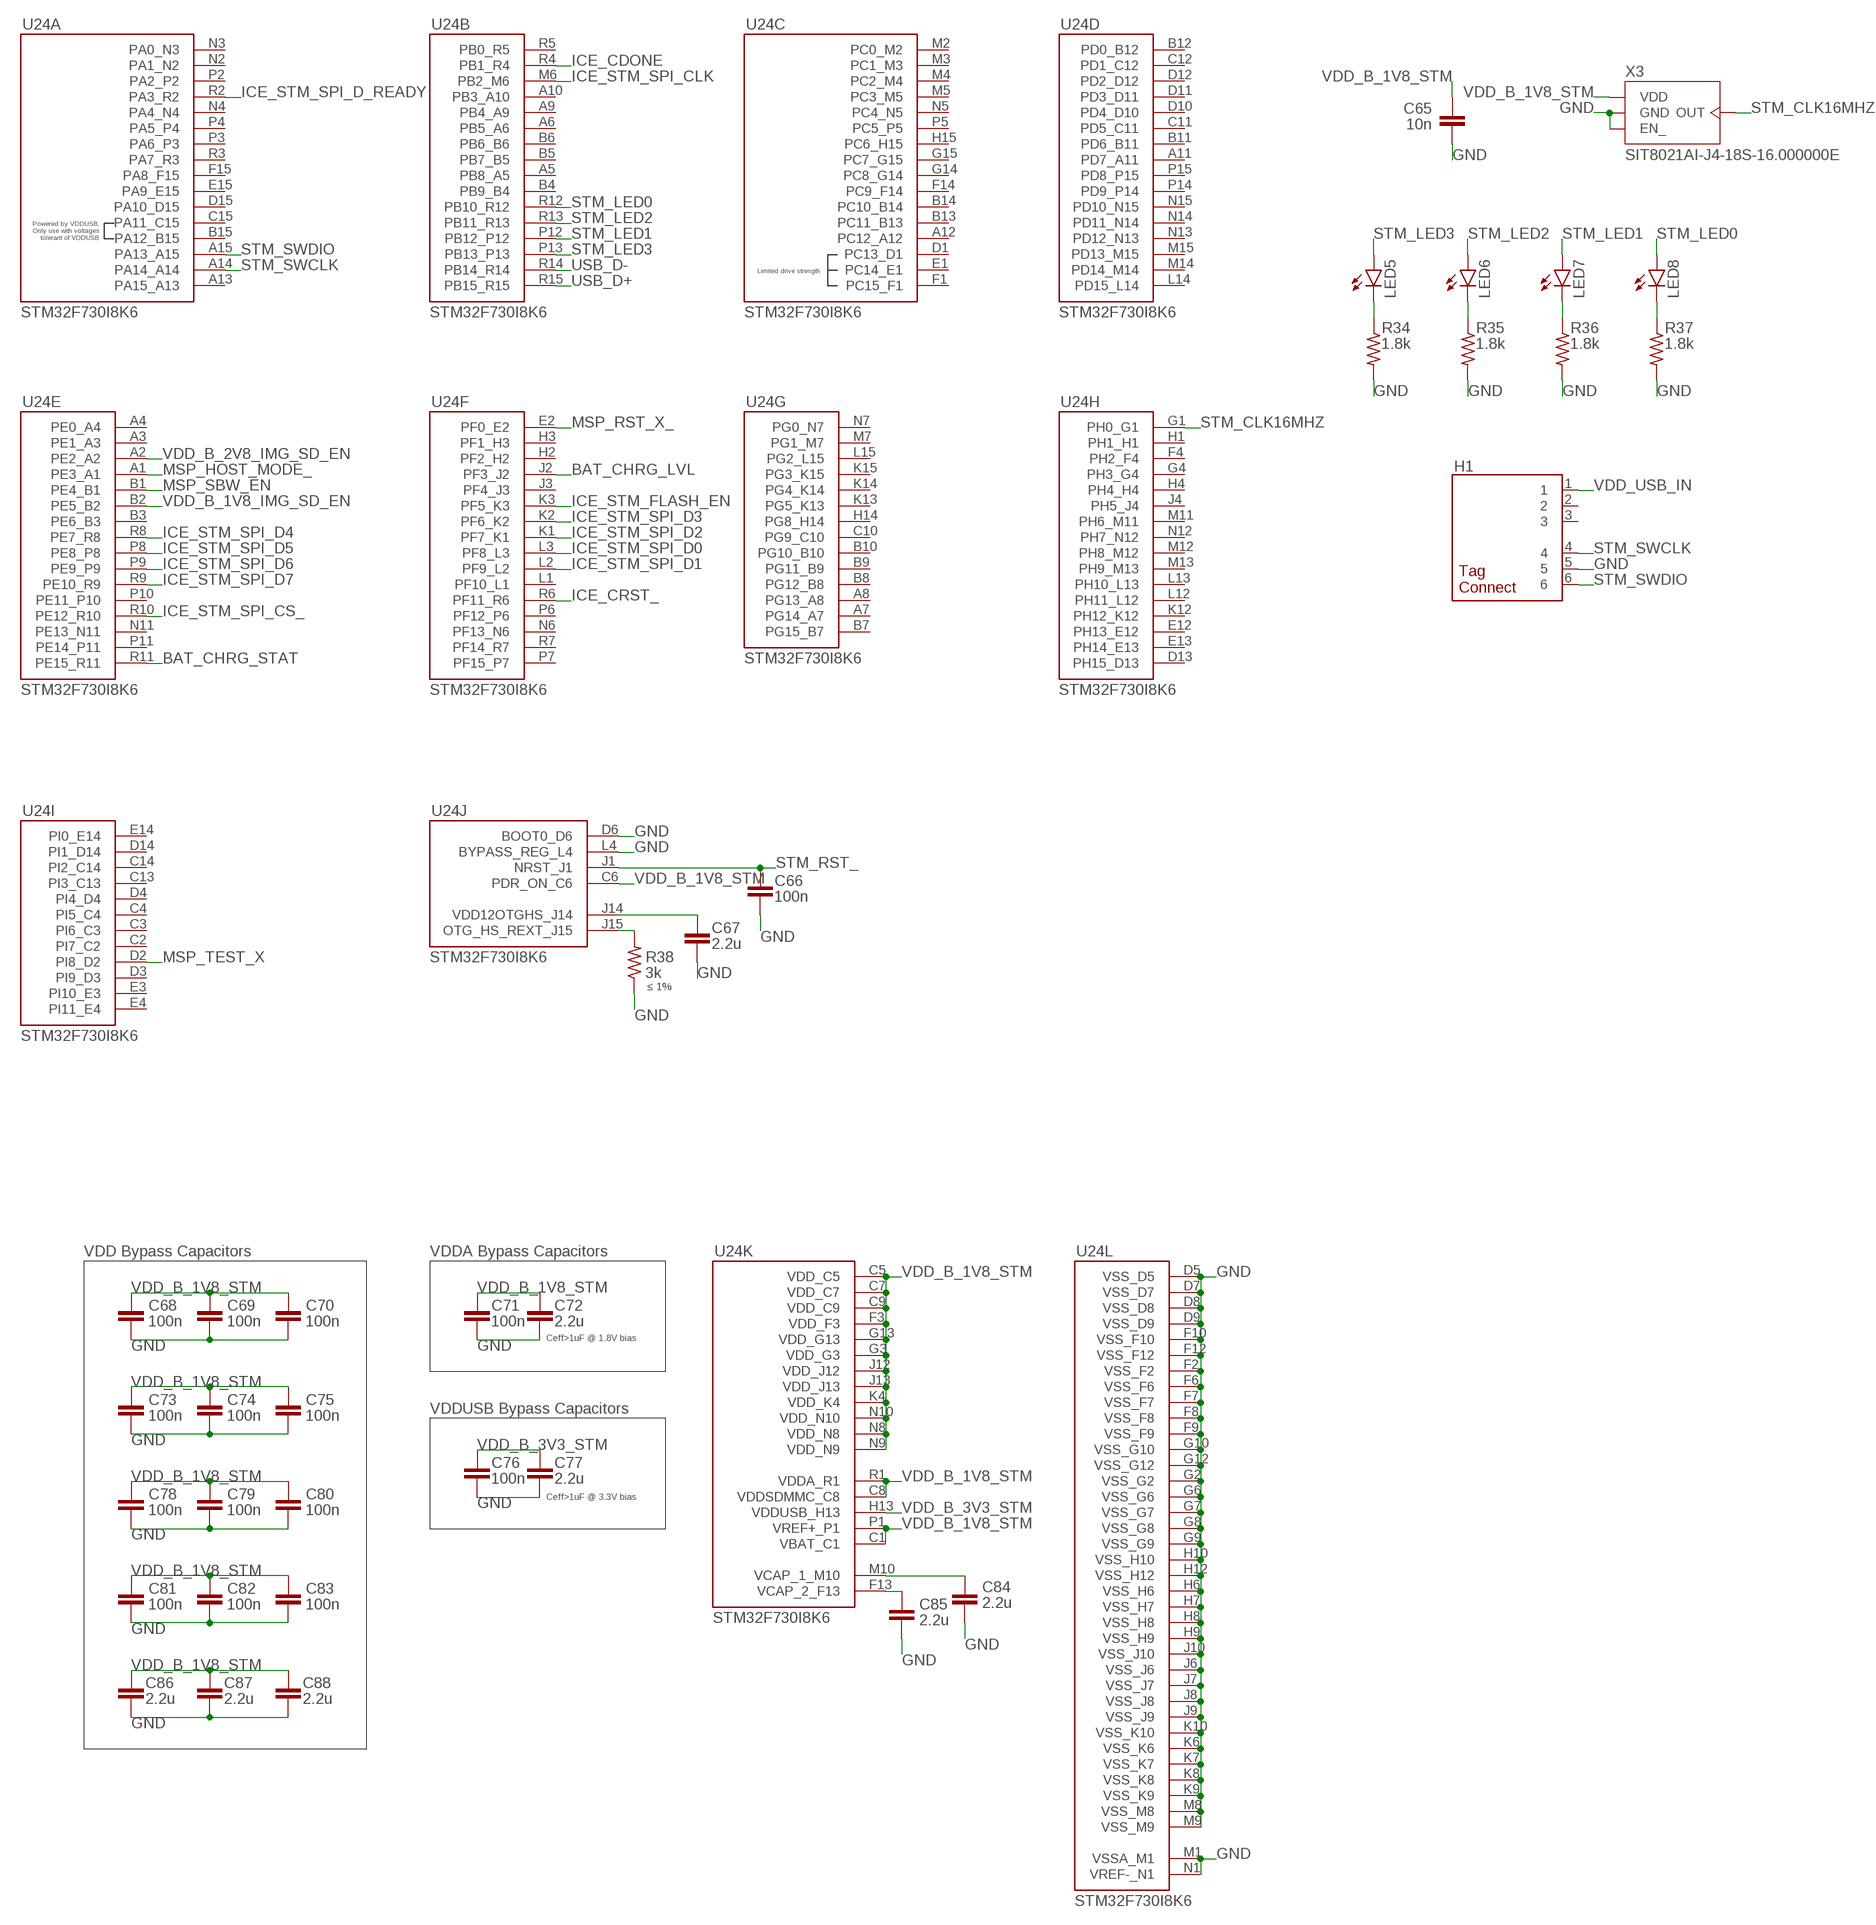
[diagram p7: schematic, sheet 8]

### Parts
C65  10n  CAPACITOR0402  [0402]
C66  100n  CAPACITOR0402  [0402]
C67  2.2u  CAPACITOR0402  [0402]
C68  100n  CAPACITOR0402  [0402]
C69  100n  CAPACITOR0402  [0402]
C70  100n  CAPACITOR0402  [0402]
C71  100n  CAPACITOR0402  [0402]
C72  2.2u  CAPACITOR0402  [0402]
C73  100n  CAPACITOR0402  [0402]
C74  100n  CAPACITOR0402  [0402]
C75  100n  CAPACITOR0402  [0402]
C76  100n  CAPACITOR0402  [0402]
C77  2.2u  CAPACITOR0402  [0402]
C78  100n  CAPACITOR0402  [0402]
C79  100n  CAPACITOR0402  [0402]
C80  100n  CAPACITOR0402  [0402]
C81  100n  CAPACITOR0402  [0402]
C82  100n  CAPACITOR0402  [0402]
C83  100n  CAPACITOR0402  [0402]
C84  2.2u  CAPACITOR0402  [0402]
C85  2.2u  CAPACITOR0402  [0402]
C86  2.2u  CAPACITOR0402  [0402]
C87  2.2u  CAPACITOR0402  [0402]
C88  2.2u  CAPACITOR0402  [0402]
H1  TAGCONNECT-TC2030-NLEDGE  [TAGCONNECT-TC2030-NL-EDGE]
LED5  LED  [LED-0603]
LED6  LED  [LED-0603]
LED7  LED  [LED-0603]
LED8  LED  [LED-0603]
R34  1.8k  RESISTOR0402  [0402]
R35  1.8k  RESISTOR0402  [0402]
R36  1.8k  RESISTOR0402  [0402]
R37  1.8k  RESISTOR0402  [0402]
R38  3k  RESISTOR0402  [0402]
U24  STM-STM32F730  [STM-STM32F730I8]
X3  SITIME-SIT8021  [SITIME-SIT8021]

### Nets
BAT_CHRG_LVL: U24.J2(F:PF3_J2) ; also sheet 1
BAT_CHRG_STAT: U24.R11(E:PE15_R11) ; also sheet 1
GND: C65.2 C66.2 C67.2 C68.2 C69.2 C70.2 C71.2 C72.2 C73.2 C74.2 C75.2 C76.2 C77.2 C78.2 C79.2 C80.2 C81.2 C82.2 C83.2 C84.2 C85.2 C86.2 C87.2 C88.2 H1.5 R34.2 R35.2 R36.2 R37.2 R38.1 U24.D5(L:VSS_D5) U24.D6(J:BOOT0_D6) U24.D7(L:VSS_D7) U24.D8(L:VSS_D8) U24.D9(L:VSS_D9) U24.F2(L:VSS_F2) U24.F6(L:VSS_F6) U24.F7(L:VSS_F7) U24.F8(L:VSS_F8) U24.F9(L:VSS_F9) U24.F10(L:VSS_F10) U24.F12(L:VSS_F12) U24.G2(L:VSS_G2) U24.G6(L:VSS_G6) U24.G7(L:VSS_G7) U24.G8(L:VSS_G8) U24.G9(L:VSS_G9) U24.G10(L:VSS_G10) U24.G12(L:VSS_G12) U24.H6(L:VSS_H6) U24.H7(L:VSS_H7) U24.H8(L:VSS_H8) U24.H9(L:VSS_H9) U24.H10(L:VSS_H10) U24.H12(L:VSS_H12) U24.J6(L:VSS_J6) U24.J7(L:VSS_J7) U24.J8(L:VSS_J8) U24.J9(L:VSS_J9) U24.J10(L:VSS_J10) U24.K6(L:VSS_K6) U24.K7(L:VSS_K7) U24.K8(L:VSS_K8) U24.K9(L:VSS_K9) U24.K10(L:VSS_K10) U24.L4(J:BYPASS_REG_L4) U24.M1(L:VSSA_M1) U24.M8(L:VSS_M8) U24.M9(L:VSS_M9) U24.N1(L:VREF-_N1) X3.1(EN_) X3.4(GND) ; also sheet 1,2,3,4,5,6,7,9
ICE_CDONE: U24.R4(B:PB1_R4) ; also sheet 4
ICE_CRST_: U24.R6(F:PF11_R6) ; also sheet 4
ICE_STM_FLASH_EN: U24.K3(F:PF5_K3) ; also sheet 4
ICE_STM_SPI_CLK: U24.M6(B:PB2_M6) ; also sheet 4
ICE_STM_SPI_CS_: U24.R10(E:PE12_R10) ; also sheet 4
ICE_STM_SPI_D0: U24.L3(F:PF8_L3) ; also sheet 4
ICE_STM_SPI_D1: U24.L2(F:PF9_L2) ; also sheet 4
ICE_STM_SPI_D2: U24.K1(F:PF7_K1) ; also sheet 4
ICE_STM_SPI_D3: U24.K2(F:PF6_K2) ; also sheet 4
ICE_STM_SPI_D4: U24.R8(E:PE7_R8) ; also sheet 4
ICE_STM_SPI_D5: U24.P8(E:PE8_P8) ; also sheet 4
ICE_STM_SPI_D6: U24.P9(E:PE9_P9) ; also sheet 4
ICE_STM_SPI_D7: U24.R9(E:PE10_R9) ; also sheet 4
ICE_STM_SPI_D_READY: U24.R2(A:PA3_R2) ; also sheet 4
MSP_HOST_MODE_: U24.A1(E:PE3_A1) ; also sheet 2
MSP_RST_X_: U24.E2(F:PF0_E2) ; also sheet 2
MSP_SBW_EN: U24.B1(E:PE4_B1) ; also sheet 2
MSP_TEST_X: U24.D2(I:PI8_D2) ; also sheet 2
N$2: C84.1 U24.M10(K:VCAP_1_M10)
N$7: C85.1 U24.F13(K:VCAP_2_F13)
N$10: R38.2 U24.J15(J:OTG_HS_REXT_J15)
N$25: C67.1 U24.J14(J:VDD12OTGHS_J14)
N$27: LED8.C R37.1
N$29: LED7.C R36.1
N$30: LED6.C R35.1
N$31: LED5.C R34.1
STM_CLK16MHZ: U24.G1(H:PH0_G1) X3.2(OUT)
STM_LED0: LED8.A U24.R12(B:PB10_R12)
STM_LED1: LED7.A U24.P12(B:PB12_P12)
STM_LED2: LED6.A U24.R13(B:PB11_R13)
STM_LED3: LED5.A U24.P13(B:PB13_P13)
STM_RST_: C66.1 U24.J1(J:NRST_J1)
STM_SWCLK: H1.4 U24.A14(A:PA14_A14)
STM_SWDIO: H1.6 U24.A15(A:PA13_A15)
USB_D+: U24.R15(B:PB15_R15) ; also sheet 9
USB_D-: U24.R14(B:PB14_R14) ; also sheet 9
VDD_B_1V8_IMG_SD_EN: U24.B2(E:PE5_B2) ; also sheet 1,2
VDD_B_1V8_STM: C65.1 C68.1 C69.1 C70.1 C71.1 C72.1 C73.1 C74.1 C75.1 C78.1 C79.1 C80.1 C81.1 C82.1 C83.1 C86.1 C87.1 C88.1 U24.C1(K:VBAT_C1) U24.C5(K:VDD_C5) U24.C6(J:PDR_ON_C6) U24.C7(K:VDD_C7) U24.C8(K:VDDSDMMC_C8) U24.C9(K:VDD_C9) U24.F3(K:VDD_F3) U24.G3(K:VDD_G3) U24.G13(K:VDD_G13) U24.J12(K:VDD_J12) U24.J13(K:VDD_J13) U24.K4(K:VDD_K4) U24.N8(K:VDD_N8) U24.N9(K:VDD_N9) U24.N10(K:VDD_N10) U24.P1(K:VREF+_P1) U24.R1(K:VDDA_R1) X3.3(VDD) ; also sheet 1,2
VDD_B_2V8_IMG_SD_EN: U24.A2(E:PE2_A2) ; also sheet 1,2
VDD_B_3V3_STM: C76.1 C77.1 U24.H13(K:VDDUSB_H13) ; also sheet 1
VDD_USB_IN: H1.1 ; also sheet 1,9
Unconnected: H1.2 H1.3 U24.A3(E:PE1_A3) U24.A4(E:PE0_A4) U24.A5(B:PB8_A5) U24.A6(B:PB5_A6) U24.A7(G:PG14_A7) U24.A8(G:PG13_A8) U24.A9(B:PB4_A9) U24.A10(B:PB3_A10) U24.A11(D:PD7_A11) U24.A12(C:PC12_A12) U24.A13(A:PA15_A13) U24.B3(E:PE6_B3) U24.B4(B:PB9_B4) U24.B5(B:PB7_B5) U24.B6(B:PB6_B6) U24.B7(G:PG15_B7) U24.B8(G:PG12_B8) U24.B9(G:PG11_B9) U24.B10(G:PG10_B10) U24.B11(D:PD6_B11) U24.B12(D:PD0_B12) U24.B13(C:PC11_B13) U24.B14(C:PC10_B14) U24.B15(A:PA12_B15) U24.C2(I:PI7_C2) U24.C3(I:PI6_C3) U24.C4(I:PI5_C4) U24.C10(G:PG9_C10) U24.C11(D:PD5_C11) U24.C12(D:PD1_C12) U24.C13(I:PI3_C13) U24.C14(I:PI2_C14) U24.C15(A:PA11_C15) U24.D1(C:PC13_D1) U24.D3(I:PI9_D3) U24.D4(I:PI4_D4) U24.D10(D:PD4_D10) U24.D11(D:PD3_D11) U24.D12(D:PD2_D12) U24.D13(H:PH15_D13) U24.D14(I:PI1_D14) U24.D15(A:PA10_D15) U24.E1(C:PC14_E1) U24.E3(I:PI10_E3) U24.E4(I:PI11_E4) U24.E12(H:PH13_E12) U24.E13(H:PH14_E13) U24.E14(I:PI0_E14) U24.E15(A:PA9_E15) U24.F1(C:PC15_F1) U24.F4(H:PH2_F4) U24.F14(C:PC9_F14) U24.F15(A:PA8_F15) U24.G4(H:PH3_G4) U24.G14(C:PC8_G14) U24.G15(C:PC7_G15) U24.H1(H:PH1_H1) U24.H2(F:PF2_H2) U24.H3(F:PF1_H3) U24.H4(H:PH4_H4) U24.H14(G:PG8_H14) U24.H15(C:PC6_H15) U24.J3(F:PF4_J3) U24.J4(H:PH5_J4) U24.K12(H:PH12_K12) U24.K13(G:PG5_K13) U24.K14(G:PG4_K14) U24.K15(G:PG3_K15) U24.L1(F:PF10_L1) U24.L12(H:PH11_L12) U24.L13(H:PH10_L13) U24.L14(D:PD15_L14) U24.L15(G:PG2_L15) U24.M2(C:PC0_M2) U24.M3(C:PC1_M3) U24.M4(C:PC2_M4) U24.M5(C:PC3_M5) U24.M7(G:PG1_M7) U24.M11(H:PH6_M11) U24.M12(H:PH8_M12) U24.M13(H:PH9_M13) U24.M14(D:PD14_M14) U24.M15(D:PD13_M15) U24.N2(A:PA1_N2) U24.N3(A:PA0_N3) U24.N4(A:PA4_N4) U24.N5(C:PC4_N5) U24.N6(F:PF13_N6) U24.N7(G:PG0_N7) U24.N11(E:PE13_N11) U24.N12(H:PH7_N12) U24.N13(D:PD12_N13) U24.N14(D:PD11_N14) U24.N15(D:PD10_N15) U24.P2(A:PA2_P2) U24.P3(A:PA6_P3) U24.P4(A:PA5_P4) U24.P5(C:PC5_P5) U24.P6(F:PF12_P6) U24.P7(F:PF15_P7) U24.P10(E:PE11_P10) U24.P11(E:PE14_P11) U24.P14(D:PD9_P14) U24.P15(D:PD8_P15) U24.R3(A:PA7_R3) U24.R5(B:PB0_R5) U24.R7(F:PF14_R7)

### Notes on the sheet
- ≤ 1%
- VDD Bypass Capacitors | VDDA Bypass Capacitors
- Ceff>1uF @ 1.8V bias
- VDDUSB Bypass Capacitors
- Ceff>1uF @ 3.3V bias

## Sheet 9 of 9: USB
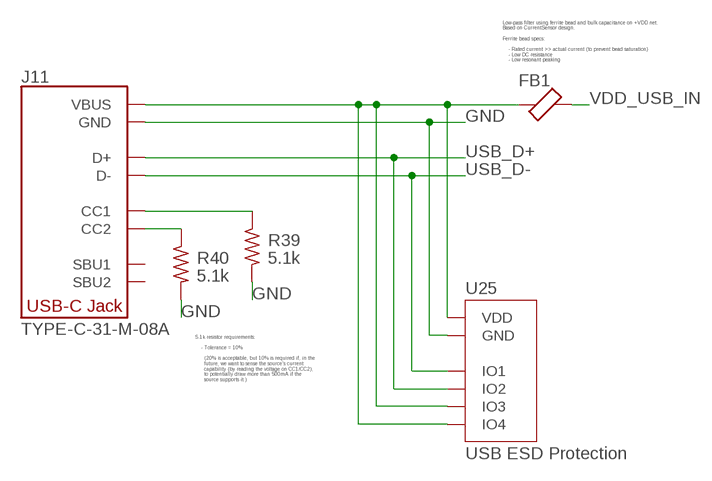
[diagram p8: schematic, sheet 9]

### Parts
FB1  FERRITE-BEAD0402  [0402]
J11  USB-C-RECEPTACLE-KOREANHRO  [KOREANHRO-TYPE-C-31-M-08A]
R39  5.1k  RESISTOR0402  [0402]
R40  5.1k  RESISTOR0402  [0402]
U25  DIODESINC-DT1446-04V-7  [DIODESINC-DT1446-04V-7]

### Nets
GND: J11.A1(GND) J11.A12(GND) J11.B1(GND) J11.B12(GND) J11.GND1(GND) J11.GND2(GND) J11.GND3(GND) J11.GND4(GND) J11.GND5(GND) J11.GND6(GND) J11.GND7(GND) J11.GND8(GND) R39.2 R40.2 U25.2(GND) ; also sheet 1,2,3,4,5,6,7,8
N$35: J11.A5(CC1) R39.1
N$36: J11.B5(CC2) R40.1
N$54: FB1.1 J11.A4(VBUS) J11.A9(VBUS) J11.B4(VBUS) J11.B9(VBUS) U25.4(IO3) U25.5(VDD) U25.6(IO4)
USB_D+: J11.A6(D+) J11.B6(D+) U25.3(IO2) ; also sheet 8
USB_D-: J11.A7(D-) J11.B7(D-) U25.1(IO1) ; also sheet 8
VDD_USB_IN: FB1.2 ; also sheet 1,8
Unconnected: J11.A8(SBU1) J11.B8(SBU2)

### Notes on the sheet
- Low-pass filter using ferrite bead and bulk capacitance on +VDD net.
  Based on CurrentSensor design.
  
  Ferrite bead specs:
  
      - Rated current >> actual current (to prevent bead saturation)
      - Low DC resistance
      - Low resonant peaking
- 5.1k resistor requirements:
  
      - Tolerance = 10%
  
        (20% is acceptable, but 10% is required if, in the
        future, we want to sense the source's current
        capability (by reading the voltage on CC1/CC2),
        to potentially draw more than 500mA if the
        source supports it.)

## Library data of the parts
C1 C5 C14-C17 C67 C72 C77 C84-C88 = EagleLibrary:CAPACITOR; MFG: Taiyo Yuden; PN: TMK105CBJ225KV-F
C2 C6 C9 C11 C13 C21 C39 C42 C46 C48 C50 C54 C57 C61-C63 = EagleLibrary:CAPACITOR; MFG: Samsung; PN: CL21A106KOQNNNE
C3 C4 C7 C20 C23-C28 C30 C32 C35 C37 C40 C43-C45 C47 C49 C51-C53 C55 C56 C58-C60 C64 C66 C68-C71 C73-C76 C78-C83 = EagleLibrary:CAPACITOR; MFG: Murata; PN: GRM155R61H104KE19D
C8 C10 C12 = EagleLibrary:CAPACITOR; MFG: Samsung; PN: CL21A226MQQNNNG
C18 C19 C22 = EagleLibrary:CAPACITOR; MFG: Murata; PN: GRM1555C1H220JA01D
C29 C31 C33 C34 C36 C38 C41 C65 = EagleLibrary:CAPACITOR; MFG: Samsung; PN: CL05B103KB5NNNC
D1 = EagleLibrary:ROHM-RB168MM-40; MFG: ROHM; PN: RB168MM-40
FB1 = EagleLibrary:FERRITE-BEAD; MFG: Taiyo Yuden; PN: BKP1005EM100-T
H1 = EagleLibrary:TAGCONNECT-TC2030-NL: TagConnect 6-pin Receptacle
J1-J4 J6-J8 = EagleLibrary:JUMPER
J5 = EagleLibrary:JST-SM02B-SRSS-TB; MFG: JST; PN: SM02B-SRSS-TB
J9 = EagleLibrary:S-MOUNT-LENS-HOLDER; MFG: M12 Lenses; PN: PT-LH008P
J10 = EagleLibrary:MICROSD-SOCKET: microSD Socket; MFG: Molex; PN: 105162-0001
J11 = EagleLibrary:USB-C-RECEPTACLE; MFG: Korean Hroparts Electronics; PN: TYPE-C-31-M-08A
L1-L3 = EagleLibrary:INDUCTOR; MFG: Samsung; PN: CIGT201610LH1R0MNE
LED1-LED8 = EagleLibrary:LED: LED; MFG: OSRAM; PN: KS DELLS1.22-JHKI-1
Q1-Q3 = EagleLibrary:PMOS: PMOS MOSFET transistor; MFG: Nexperia; PN: PMPB10UPX
R1 R3 R4 R8-R12 R14 R16 = EagleLibrary:RESISTOR; MFG: Yageo; PN: RC0402FR-07100KL
R2 R7 = EagleLibrary:RESISTOR; MFG: Walsin; PN: WR04X3003FTL
R5 R17 R24-R28 = EagleLibrary:RESISTOR; MFG: Yageo; PN: RC0402JR-0710KL
R6 = EagleLibrary:RESISTOR; MFG: Bourns; PN: CR0402-JW-272GLF
R13 = EagleLibrary:RESISTOR; MFG: Yageo; PN: RC0402FR-13200KL
R15 = EagleLibrary:RESISTOR; MFG: Walsin; PN: WR04X3653FTL
R18-R21 R34-R37 = EagleLibrary:RESISTOR; MFG: Yageo; PN: RC0402FR-071K8L
R22 R23 = EagleLibrary:RESISTOR; MFG: Walsin; PN: WR04X1000FQL
R29-R33 = EagleLibrary:RESISTOR; MFG: Walsin; PN: WR04X473 JTL
R38 = EagleLibrary:RESISTOR; MFG: Yageo; PN: AC0402FR-073KL
R39 R40 = EagleLibrary:RESISTOR; MFG: Yageo; PN: AC0402FR-075K1L
TP2 = EagleLibrary:TEST-POINT: Bare copper test point
U1 = EagleLibrary:TI-TPS2116; MFG: Texas Instruments; PN: TPS2116DRLR
U2 = EagleLibrary:DIODESINC-AP7350; MFG: Diodes Incorporated; PN: AP7350-33CF4-7
U3 = EagleLibrary:NEXPERIA-74LVC1G98-NOR; MFG: Nexperia; PN: 74LVC1G98GW,125
U4 = EagleLibrary:MICROCHIP-MCP7383X; MFG: Microchip; PN: MCP73831T-2ACI/OT
U5 U21 = EagleLibrary:NEXPERIA-74LVC1G98-BUFFER; MFG: Nexperia; PN: 74LVC1G98GW,125
U6 = EagleLibrary:EATON-STN101; MFG: Eaton; PN: STN101050B101
U7-U9 = EagleLibrary:TI-TPS62A01; MFG: Texas Instruments; PN: TPS62A01DRLR
U10-U13 = EagleLibrary:TI-TPS22919DCK; MFG: Texas Instruments; PN: TPS22919DCK
U14 = EagleLibrary:TI-MSP430FR2422IRHL; MFG: Texas Instruments; PN: MSP430FR2422IRHL
U15 U16 = EagleLibrary:NXP-NTB0102; MFG: NXP; PN: NTB0102GF
U17 = EagleLibrary:PANASONIC-EKMB110711X: Motion sensor; MFG: Panasonic; PN: EKMB1107112
U18 = EagleLibrary:LATTICE-ICE40HX4K-BG121: Lattice ICE40 FPGA; MFG: Lattice; PN: ICE40HX4K-BG121
U19 = EagleLibrary:WINBOND-W25Q40EW; MFG: Winbond; PN: W25Q40EWUXIE
U20 = EagleLibrary:NEXPERIA-74LVC1G98-OR-INV-INPUT; MFG: Nexperia; PN: 74LVC1G98GW,125
U22 = EagleLibrary:ON-AR0330CS1C12SPKA0: 3.4 Megapixel CMOS Image Sensor; MFG: ON Semiconductor; PN: AR0330CS1C12SPKA0-CR
U23 = EagleLibrary:ALLIANCE-AS4C8M16MSA-6BIN: 128M Low Power SDRAM; MFG: Alliance Memory; PN: AS4C8M16MSA-6BIN
U24 = EagleLibrary:STM-STM32F730; MFG: STMicroelectronics; PN: STM32F730I8K6
U25 = EagleLibrary:DIODESINC-DT1446-04V-7; MFG: Diodes Incorporated; PN: DT1446-04V-7
X1 = EagleLibrary:EPSON-FC-135; MFG: Epson; PN: Q13FC13500005
X2 X3 = EagleLibrary:SITIME-SIT8021: MEMS Oscillator; MFG: SiTime; PN: SIT8021AI-J4-18S-16.000000E